# Altium project EASY-EAI-Nano-TB V1.01.PrjPcb (part 3 of 4)

## Sheet 09.Ethernet-RGMII.SchDoc
size A3; CheckDate: CheckedDate; CheckedBy: YPC; DocumentNumber: 9; Revision: V1.00; SheetNumber: 09; SheetTotal: 18; SheetName: Ethernet-RGMII; SheetDescribe: 千兆以太网; Designer: JOW; DesignDate: 2025-04-25; CheckedData: 2025-04-25; Rule: PcbType=ProtelPcb
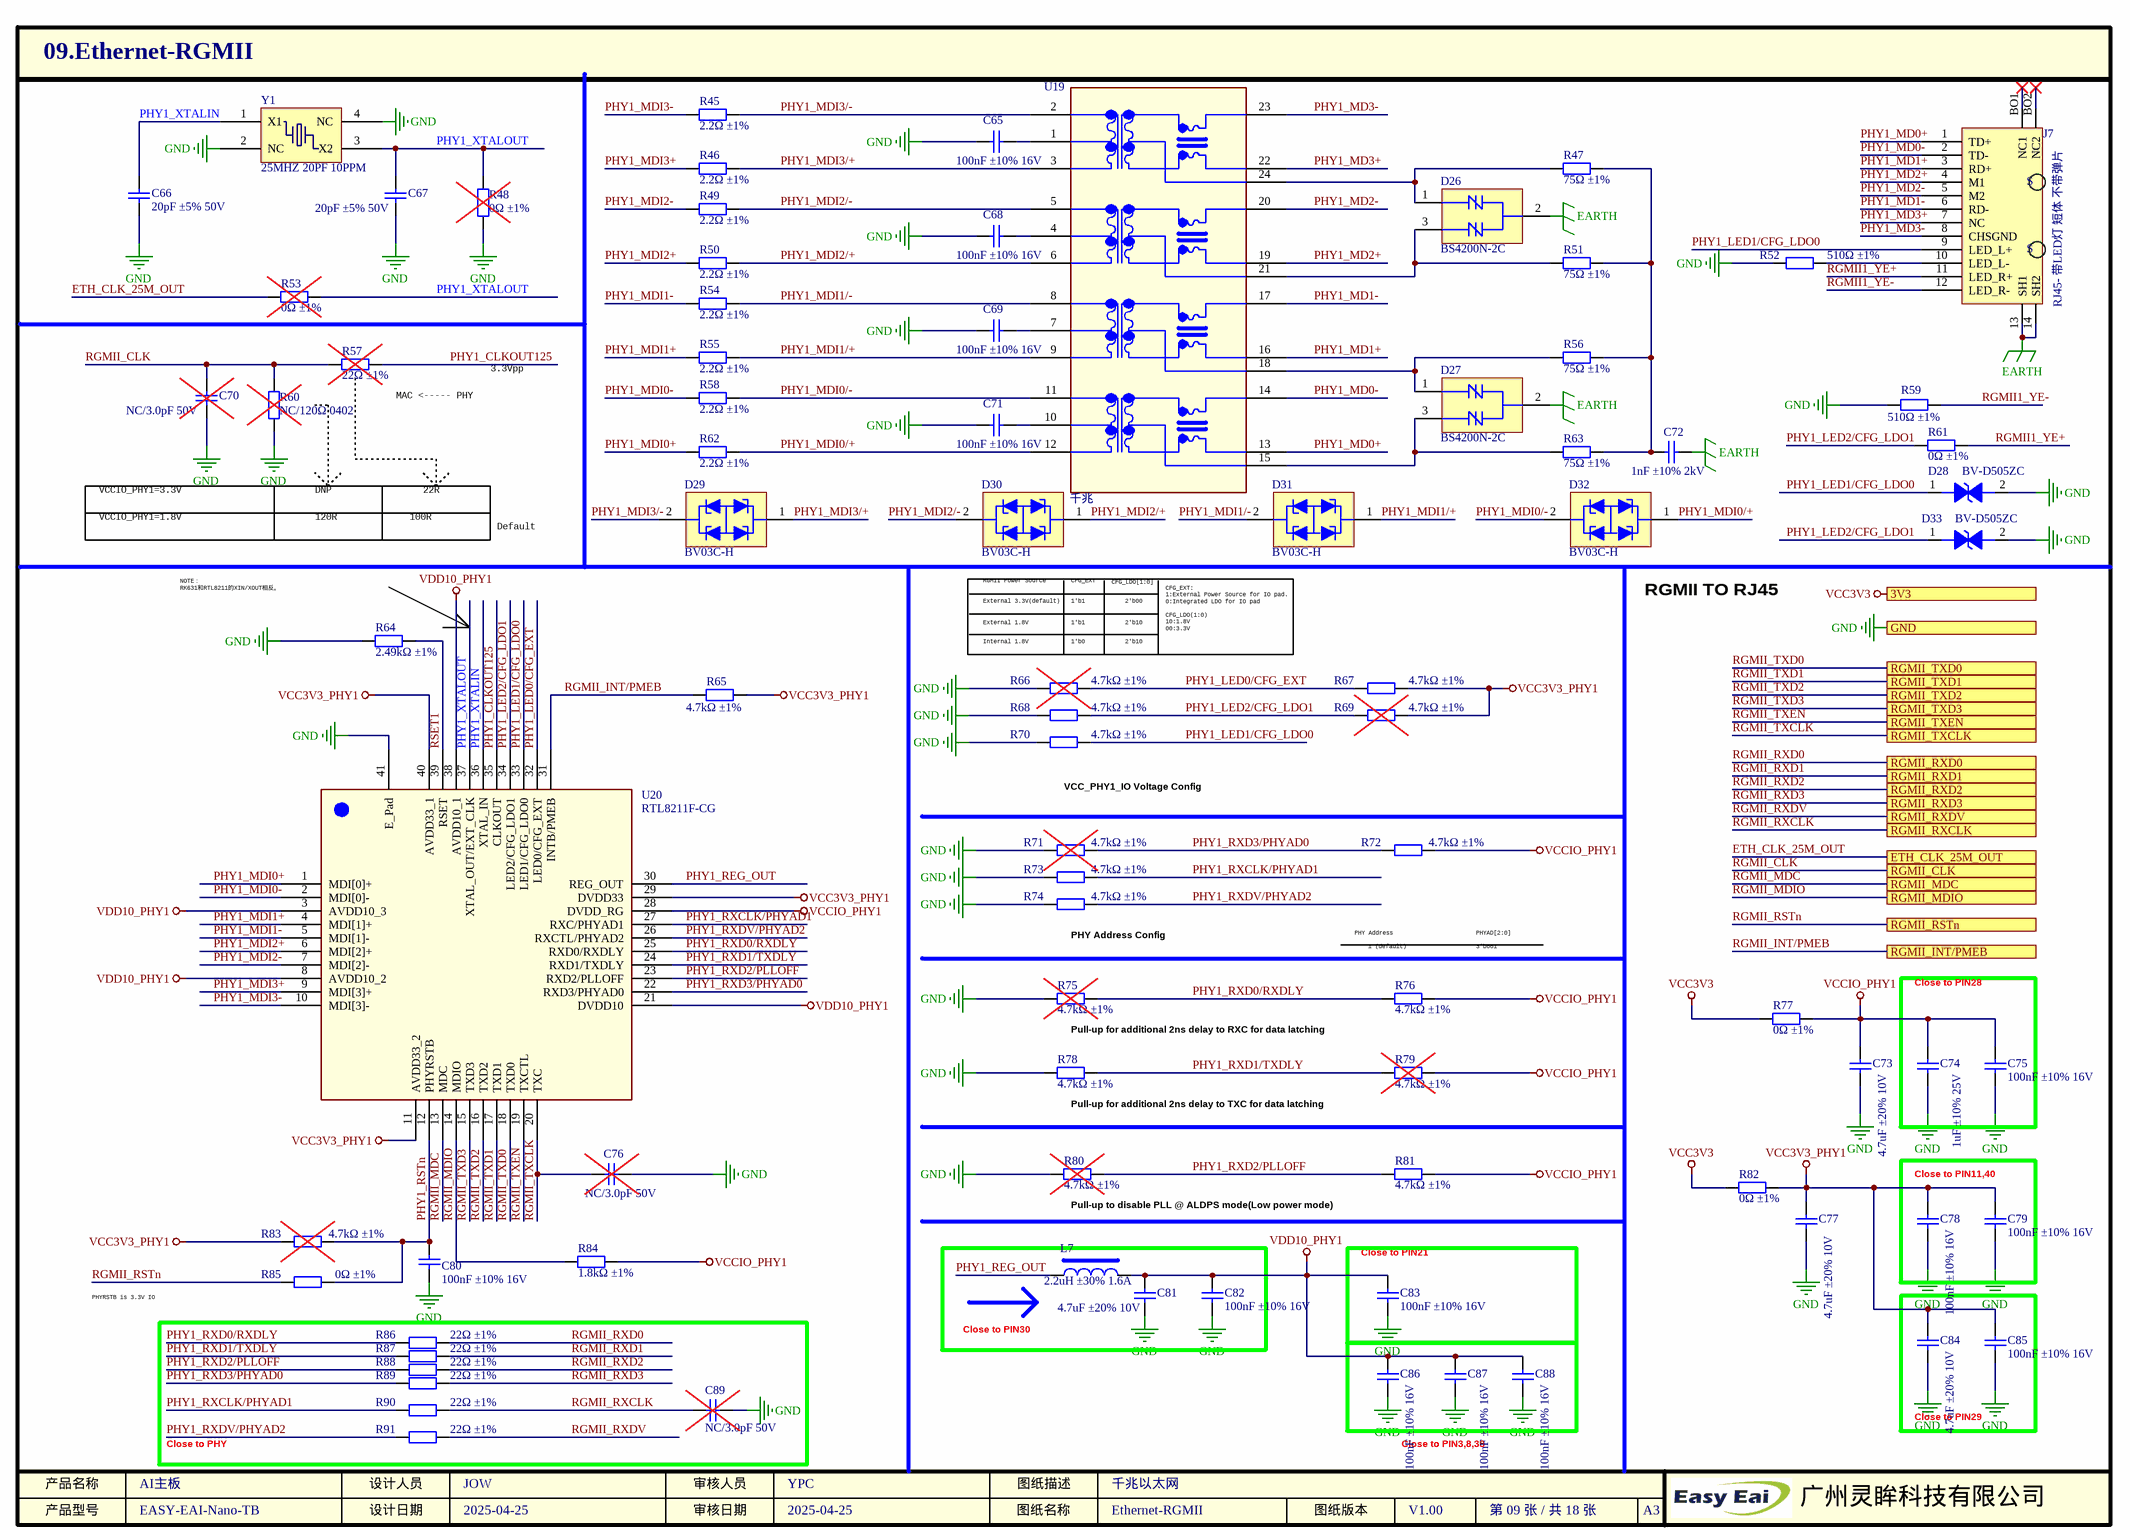
[diagram p12: 09.Ethernet-RGMII.SchDoc]

### Parts
C65  描述: 100nF ±10% 16V  [0402_C]  (hidden comment: CL05B104KO5NNNC)
C66  描述: 20pF ±5% 50V  [0402_C]  (hidden comment: 0402CG200J500NT)
C67  描述: 20pF ±5% 50V  [0402_C]  (hidden comment: 0402CG200J500NT)
C68  描述: 100nF ±10% 16V  [0402_C]  (hidden comment: CL05B104KO5NNNC)
C69  描述: 100nF ±10% 16V  [0402_C]  (hidden comment: CL05B104KO5NNNC)
C70  NC/3.0pF 50V  [0402_C]  (no BOM)
C71  描述: 100nF ±10% 16V  [0402_C]  (hidden comment: CL05B104KO5NNNC)
C72  描述: 1nF ±10% 2kV  [1206_C]  (hidden comment: CC1206KKX7RDBB102)
C73  描述: 4.7uF ±20% 10V  [0402_C]  (hidden comment: CL05A475MP5NRNC)
C74  描述: 1uF ±10% 25V  [0402_C]  (hidden comment: CL05A105KA5NQNC)
C75  描述: 100nF ±10% 16V  [0402_C]  (hidden comment: CL05B104KO5NNNC)
C76  NC/3.0pF 50V  [0402_C]  (no BOM)
C77  描述: 4.7uF ±20% 10V  [0402_C]  (hidden comment: CL05A475MP5NRNC)
C78  描述: 100nF ±10% 16V  [0402_C]  (hidden comment: CL05B104KO5NNNC)
C79  描述: 100nF ±10% 16V  [0402_C]  (hidden comment: CL05B104KO5NNNC)
C80  描述: 100nF ±10% 16V  [0402_C]  (hidden comment: CL05B104KO5NNNC)
C81  描述: 4.7uF ±20% 10V  [0402_C]  (hidden comment: CL05A475MP5NRNC)
C82  描述: 100nF ±10% 16V  [0402_C]  (hidden comment: CL05B104KO5NNNC)
C83  描述: 100nF ±10% 16V  [0402_C]  (hidden comment: CL05B104KO5NNNC)
C84  描述: 4.7uF ±20% 10V  [0402_C]  (hidden comment: CL05A475MP5NRNC)
C85  描述: 100nF ±10% 16V  [0402_C]  (hidden comment: CL05B104KO5NNNC)
C86  描述: 100nF ±10% 16V  [0402_C]  (hidden comment: CL05B104KO5NNNC)
C87  描述: 100nF ±10% 16V  [0402_C]  (hidden comment: CL05B104KO5NNNC)
C88  描述: 100nF ±10% 16V  [0402_C]  (hidden comment: CL05B104KO5NNNC)
C89  NC/3.0pF 50V  [0402_C]  (no BOM)
D26  BS4200N-2C  [SMB-T_L5.4-W3.3-BI]
D27  BS4200N-2C  [SMB-T_L5.4-W3.3-BI]
D28  BV-D505ZC  [SOD-523]
D29  BV03C-H  [SOD-323]
D30  BV03C-H  [SOD-323]
D31  BV03C-H  [SOD-323]
D32  BV03C-H  [SOD-323]
D33  BV-D505ZC  [SOD-523]
J7  R-RJ45R08P-C000  [RJ45/LED-1575X1626X1310]  (value not drawn)
L7  SWPA3015S2R2NT  [IND-SMD_L3.0-W3.0]  (value not drawn)
R45  描述: 2.2Ω ±1%  [0402_R]  (hidden comment: 0402WGF220KTCE)
R46  描述: 2.2Ω ±1%  [0402_R]  (hidden comment: 0402WGF220KTCE)
R47  描述: 75Ω ±1%  [0805_R]  (hidden comment: RS-05K75R0FT)
R48  描述: 0Ω ±1%  [0402_R]  (hidden comment: NC/0402WGF0000TCE)  (no BOM)
R49  描述: 2.2Ω ±1%  [0402_R]  (hidden comment: 0402WGF220KTCE)
R50  描述: 2.2Ω ±1%  [0402_R]  (hidden comment: 0402WGF220KTCE)
R51  描述: 75Ω ±1%  [0805_R]  (hidden comment: RS-05K75R0FT)
R52  描述: 510Ω ±1%  [0402_R]  (hidden comment: 0402WGF5100TCE)
R53  描述: 0Ω ±1%  [0402_R]  (hidden comment: NC/0402WGF0000TCE)  (no BOM)
R54  描述: 2.2Ω ±1%  [0402_R]  (hidden comment: 0402WGF220KTCE)
R55  描述: 2.2Ω ±1%  [0402_R]  (hidden comment: 0402WGF220KTCE)
R56  描述: 75Ω ±1%  [0805_R]  (hidden comment: RS-05K75R0FT)
R57  描述: 22Ω ±1%  [0402_R]  (hidden comment: 0402WGF220JTCE)  (no BOM)
R58  描述: 2.2Ω ±1%  [0402_R]  (hidden comment: 0402WGF220KTCE)
R59  描述: 510Ω ±1%  [0402_R]  (hidden comment: 0402WGF5100TCE)
R60  NC/120Ω 0402  [0402_R]  (no BOM)
R61  描述: 0Ω ±1%  [0402_R]  (hidden comment: 0402WGF0000TCE)
R62  描述: 2.2Ω ±1%  [0402_R]  (hidden comment: 0402WGF220KTCE)
R63  描述: 75Ω ±1%  [0805_R]  (hidden comment: RS-05K75R0FT)
R64  描述: 2.49kΩ ±1%  [0402_R]  (hidden comment: AC0402FR-072K49L)
R65  描述: 4.7kΩ ±1%  [0402_R]  (hidden comment: 0402WGF4701TCE)
R66  描述: 4.7kΩ ±1%  [0402_R]  (hidden comment: NC/0402WGF4701TCE)  (no BOM)
R67  描述: 4.7kΩ ±1%  [0402_R]  (hidden comment: 0402WGF4701TCE)
R68  描述: 4.7kΩ ±1%  [0402_R]  (hidden comment: 0402WGF4701TCE)
R69  描述: 4.7kΩ ±1%  [0402_R]  (hidden comment: NC/0402WGF4701TCE)  (no BOM)
R70  描述: 4.7kΩ ±1%  [0402_R]  (hidden comment: 0402WGF4701TCE)
R71  描述: 4.7kΩ ±1%  [0402_R]  (hidden comment: NC/0402WGF4701TCE)  (no BOM)
R72  描述: 4.7kΩ ±1%  [0402_R]  (hidden comment: 0402WGF4701TCE)
R73  描述: 4.7kΩ ±1%  [0402_R]  (hidden comment: 0402WGF4701TCE)
R74  描述: 4.7kΩ ±1%  [0402_R]  (hidden comment: 0402WGF4701TCE)
R75  描述: 4.7kΩ ±1%  [0402_R]  (hidden comment: NC/0402WGF4701TCE)  (no BOM)
R76  描述: 4.7kΩ ±1%  [0402_R]  (hidden comment: 0402WGF4701TCE)
R77  描述: 0Ω ±1%  [0402_R]  (hidden comment: 0402WGF0000TCE)
R78  描述: 4.7kΩ ±1%  [0402_R]  (hidden comment: 0402WGF4701TCE)
R79  描述: 4.7kΩ ±1%  [0402_R]  (hidden comment: NC/0402WGF4701TCE)  (no BOM)
R80  描述: 4.7kΩ ±1%  [0402_R]  (hidden comment: NC/0402WGF4701TCE)  (no BOM)
R81  描述: 4.7kΩ ±1%  [0402_R]  (hidden comment: 0402WGF4701TCE)
R82  描述: 0Ω ±1%  [0402_R]  (hidden comment: 0402WGF0000TCE)
R83  描述: 4.7kΩ ±1%  [0402_R]  (hidden comment: NC/0402WGF4701TCE)  (no BOM)
R84  描述: 1.8kΩ ±1%  [0402_R]  (hidden comment: 0402WGF1801TCE)
R85  描述: 0Ω ±1%  [0402_R]  (hidden comment: 0402WGF0000TCE)
R86  描述: 22Ω ±1%  [0402_R]  (hidden comment: 0402WGF220JTCE)
R87  描述: 22Ω ±1%  [0402_R]  (hidden comment: 0402WGF220JTCE)
R88  描述: 22Ω ±1%  [0402_R]  (hidden comment: 0402WGF220JTCE)
R89  描述: 22Ω ±1%  [0402_R]  (hidden comment: 0402WGF220JTCE)
R90  描述: 22Ω ±1%  [0402_R]  (hidden comment: 0402WGF220JTCE)
R91  描述: 22Ω ±1%  [0402_R]  (hidden comment: 0402WGF220JTCE)
U19  描述: 千兆  [SMD-24_L15.1-W7.1-P1.00-LS10.0-BL]  (hidden comment: G2401CE)
U20  RTL8211F-CG  [QFN40P500X500X90_HS-41N]
Y1  X322525MSB4SI  [SMD-3225_4P]  (value not drawn)

### Blocks framed on the sheet
Close to PIN28: C74 C75
Close to PIN11,40: C78 C79
Close to PIN30: C81 C82 L7
Close to PIN21: C83
Close to PHY: C89 R86-R91
Close to PIN29: C84 C85

### Ports
3V3, ETH_CLK_25M_OUT, GND, RGMII_CLK, RGMII_INT/PMEB, RGMII_MDC, RGMII_MDIO, RGMII_RSTn, RGMII_RXCLK, RGMII_RXD0, RGMII_RXD1, RGMII_RXD2, RGMII_RXD3, RGMII_RXDV, RGMII_TXCLK, RGMII_TXD0, RGMII_TXD1, RGMII_TXD2, RGMII_TXD3, RGMII_TXEN

### Nets
EARTH: C72.2 D26.2 D27.2 J7.13(SH1) J7.14(SH2)
GND: C65.1 C66.1 C67.1 C68.1 C69.1 C70.1 C71.1 C73.1 C74.1 C75.1 C76.2 C77.1 C78.1 C79.1 C80.1 C81.1 C82.1 C83.1 C84.1 C85.1 C86.1 C87.1 C88.1 C89.1 D28.2 D33.2 R48.1 R52.1 R59.1 R60.1 R64.1 R66.1 R68.1 R70.1 R71.1 R73.1 R74.1 R75.1 R78.1 R80.1 U20.41(E_Pad) Y1.2(NC) Y1.4(NC) ; port GND  [project net CHIP_GND]
VCC3V3: R77.1 R82.1 ; port 3V3
VCC3V3_PHY1: C77.2 C78.2 C79.2 C84.2 C85.2 R65.2 R67.2 R69.2 R82.2 R83.1 U20.11(AVDD33_2) U20.29(DVDD33) U20.40(AVDD33_1)
VCCIO_PHY1: C73.2 C74.2 C75.2 R72.2 R76.2 R77.2 R79.2 R81.2 R84.2 U20.28(DVDD_RG)
VDD10_PHY1: C81.2 C82.2 C83.2 C86.2 C87.2 C88.2 L7.2 U20.3(AVDD10_3) U20.8(AVDD10_2) U20.21(DVDD10) U20.38(AVDD10_1)
ETH_CLK_25M_OUT: R53.2 ; port ETH_CLK_25M_OUT
PHY1_CLKOUT125: R57.2 U20.35(CLKOUT)
PHY1_LED0/CFG_EXT: R66.2 R67.1 U20.32(LED0/CFG_EXT)
PHY1_LED1/CFG_LDO0: D28.1 J7.9(LED_L+) R70.2 U20.33(LED1/CFG_LDO0)
PHY1_LED2/CFG_LDO1: D33.1 R61.1 R68.2 R69.1 U20.34(LED2/CFG_LDO1)
PHY1_MD0+: J7.1(TD+) U19.13
PHY1_MD0-: J7.2(TD-) U19.14
PHY1_MD1+: J7.3(RD+) U19.16
PHY1_MD1-: J7.6(RD-) U19.17
PHY1_MD2+: J7.4(M1) U19.19
PHY1_MD2-: J7.5(M2) U19.20
PHY1_MD3+: J7.7(NC) U19.22
PHY1_MD3-: J7.8(CHSGND) U19.23
PHY1_MDI0+: R62.1 U20.1(MDI[0]+)
PHY1_MDI0-: R58.1 U20.2(MDI[0]-)
PHY1_MDI0/+: D32.1 R62.2 U19.12
PHY1_MDI0/-: D32.2 R58.2 U19.11
PHY1_MDI1+: R55.1 U20.4(MDI[1]+)
PHY1_MDI1-: R54.1 U20.5(MDI[1]-)
PHY1_MDI1/+: D31.1 R55.2 U19.9
PHY1_MDI1/-: D31.2 R54.2 U19.8
PHY1_MDI2+: R50.1 U20.6(MDI[2]+)
PHY1_MDI2-: R49.1 U20.7(MDI[2]-)
PHY1_MDI2/+: D30.1 R50.2 U19.6
PHY1_MDI2/-: D30.2 R49.2 U19.5
PHY1_MDI3+: R46.1 U20.9(MDI[3]+)
PHY1_MDI3-: R45.1 U20.10(MDI[3]-)
PHY1_MDI3/+: D29.1 R46.2 U19.3
PHY1_MDI3/-: D29.2 R45.2 U19.2
PHY1_REG_OUT: L7.1 U20.30(REG_OUT)
PHY1_RSTn: C80.2 R83.2 R85.2 U20.12(PHYRSTB)
PHY1_RXCLK/PHYAD1: R73.2 R90.1 U20.27(RXC/PHYAD1)
PHY1_RXD0/RXDLY: R75.2 R76.1 R86.1 U20.25(RXD0/RXDLY)
PHY1_RXD1/TXDLY: R78.2 R79.1 R87.1 U20.24(RXD1/TXDLY)
PHY1_RXD2/PLLOFF: R80.2 R81.1 R88.1 U20.23(RXD2/PLLOFF)
PHY1_RXD3/PHYAD0: R71.2 R72.1 R89.1 U20.22(RXD3/PHYAD0)
PHY1_RXDV/PHYAD2: R74.2 R91.1 U20.26(RXCTL/PHYAD2)
PHY1_XTALIN: C66.2 U20.36(XTAL_IN) Y1.1(X1)
PHY1_XTALOUT: C67.2 R48.2 R53.1 U20.37(XTAL_OUT/EXT_CLK) Y1.3(X2)
RGMII1_YE+: J7.11(LED_R+) R61.2
RGMII1_YE-: J7.12(LED_R-) R59.2
RGMII_CLK: C70.2 R57.1 R60.2 ; port RGMII_CLK
RGMII_INT/PMEB: R65.1 U20.31(INTB/PMEB) ; port RGMII_INT/PMEB
RGMII_MDC: U20.13(MDC) ; port RGMII_MDC
RGMII_MDIO: R84.1 U20.14(MDIO) ; port RGMII_MDIO
RGMII_RSTn: R85.1 ; port RGMII_RSTn
RGMII_RXCLK: C89.2 R90.2 ; port RGMII_RXCLK
RGMII_RXD0: R86.2 ; port RGMII_RXD0
RGMII_RXD1: R87.2 ; port RGMII_RXD1
RGMII_RXD2: R88.2 ; port RGMII_RXD2
RGMII_RXD3: R89.2 ; port RGMII_RXD3
RGMII_RXDV: R91.2 ; port RGMII_RXDV
RGMII_TXCLK: C76.1 U20.20(TXC) ; port RGMII_TXCLK
RGMII_TXD0: U20.18(TXD0) ; port RGMII_TXD0
RGMII_TXD1: U20.17(TXD1) ; port RGMII_TXD1
RGMII_TXD2: U20.16(TXD2) ; port RGMII_TXD2
RGMII_TXD3: U20.15(TXD3) ; port RGMII_TXD3
RGMII_TXEN: U20.19(TXCTL) ; port RGMII_TXEN
RSET1: R64.2 U20.39(RSET)
NetC65_2: C65.2 U19.1
NetC68_2: C68.2 U19.4
NetC69_2: C69.2 U19.7
NetC71_2: C71.2 U19.10
NetC72_1: C72.1 R47.2 R51.2 R56.2 R63.2
NetD26_1: D26.1 R47.1 U19.24
NetD26_3: D26.3 R51.1 U19.21
NetD27_1: D27.1 R56.1 U19.18
NetD27_3: D27.3 R63.1 U19.15
NetJ7_10: J7.10(LED_L-) R52.2

Not connected (* = marked no-connect by the designer): J7 BO1(NC1)* BO2(NC2)*

### Notes on the sheet
- (near R57) MAC <----- PHY
- 3.3Vpp
- VCCIO_PHY1=3.3V
- VCCIO_PHY1=1.8V
- DNP
- 120R
- 100R
- 22R
- Default
- (near R64) NOTE：
  RK631和RTL8211的XIN/XOUT相反。
- RGMII Power Source
- External 3.3V(default)
- CFG_EXT
- 1'b1
- CFG_LDO[1:0]
- 2'b00
- RGMII TO RJ45
- External 1.8V
- Internal 1.8V
- (near R66) 1'b0
- 2'b10
- CFG_EXT:
  1:External Power Source for IO pad.
  0:Integrated LDO for IO pad
  CFG_LDO(1:0)
  10:1.8V
  00:3.3V
- VCC_PHY1_IO Voltage Config
- (near R74) PHY Address Config
- PHY Address
- PHYAD[2:0]
- (near R76) 1 (default)
- 3'b001
- Pull-up for additional 2ns delay to RXC for data latching
- (near R78) Pull-up for additional 2ns delay to TXC for data latching
- (near R80) Pull-up to disable PLL @ ALDPS mode(Low power mode)
- PHYRSTB is 3.3V IO
- Close to PIN3,8,38
- 产品名称
- 产品型号
- 设计人员
- 设计日期
- 审核人员
- 审核日期
- 图纸名称
- 图纸描述
- 图纸版本
- A3
- 广州灵眸科技有限公司
- (in symbol RJ45- 带LED灯 短体 不带弹片) S

### Library data of the parts
C65 C68 C69 C71 C75 C78-C80 C82 C83 C85-C88 = 0402 100nF ±10% 16V: as C212 on sheet 17.Other; 型号: CL05B104KO5NNNC; SuppliersPartNumber: C1525; 商品编号: SPZL000259
C66 C67 = 0402 20pF ±5% 50V: SPZL000398; 名称: 贴片电容; 厂商: FH(风华); 封装: 0402; 工作温度: -55~125℃; 贴片和直插: SMD; 型号: 0402CG200J500NT; SuppliersPartNumber: C1554; 商品编号: SPZL000398
C70 C76 C89 = 0402 2.0pF (2R0) 0.25pF 50V: 贴片电容; ComponentLink1Description: 供应商链接; ComponentLink1URL: http://www.szlcsc.com/product/details_1910.html; Package: 0402; Supplier: LC
C72 = 1206 1nF ±10% 2kV: SPZL000332; 名称: 贴片电容; 厂商: YAGEO(国巨); 封装: 1206; 工作温度: -55~125℃; 贴片和直插: SMD; 型号: CC1206KKX7RDBB102; SuppliersPartNumber: C23631; 商品编号: SPZL000332
C73 C77 C81 C84 = 0402 4.7uF ±20% 10V: SPZL000339; 名称: 贴片电容; 厂商: SAMSUNG(三星); 封装: 0402; 工作温度: -55~85℃; 贴片和直插: SMD; 型号: CL05A475MP5NRNC; SuppliersPartNumber: C23733; 商品编号: SPZL000339
C74 = 0402 1uF ±10% 25V: as C213 on sheet 17.Other; 型号: CL05A105KA5NQNC; SuppliersPartNumber: C52923; 商品编号: SPZL000337
D26 D27 = 放电管 BS4200N-2C: SPZL000612; 名称: 放电管; 封装: SMB-T; 贴片和直插: SMD; 厂商: Bencent(槟城); 工作温度: -40~125℃; 商品编号: SPZL000612; 型号: BS4200N-2C
D28 D33 = ESD BV-D505ZC: SPZL000613; 名称: ESD; 贴片和直插: SMD; 厂商: Bencent(槟城); 描述: Vdrm=5V Cj=15pF; 工作温度: -40~125℃; SuppliersPartNumber: C459520; 封装: SOD-523; 商品编号: SPZL000613; 型号: BV-D505ZC
D29-D32 = ESD BV03C-H: SPZL000614; 名称: ESD; 贴片和直插: SMD; 厂商: Bencent(槟城); 描述: Vdrm=3.3V Cj=1.5pF; 工作温度: -55~150℃; 封装: SOD-323; SuppliersPartNumber: C883203; 商品编号: SPZL000614; 型号: BV03C-H
J7 = RJ45- 带LED灯 短体 不带弹片: SPZL000140; 名称: RJ45插座; 贴片和直插: THT; 封装: Through Hole; 厂商: Ckmtw(灿科盟); 工作温度: 0~70℃; SuppliersPartNumber: C386757; 型号: R-RJ45R08P-C000; 商品编号: SPZL000140; 描述: RJ45- 带LED灯 短体 不带弹片
L7 = 2.2uH ±30% 1.6A: SPZL000721; 名称: 电感; 厂商: Sunlord(顺络); 封装: SMD; 工作温度: -40~125℃; 型号: SWPA3015S2R2NT; SuppliersPartNumber: C19734; 贴片和直插: SMD; 商品编号: SPZL000721; 描述: 2.2uH ±30% 1.6A
R45 R46 R49 R50 R54 R55 R58 R62 = 0402 2.2Ω ±1%: as R217 on sheet 17.Other; SuppliersPartNumber: C25101; 型号: 0402WGF220KTCE; 商品编号: SPZL000327
R47 R51 R56 R63 = 0805 75Ω ±1%: SPZL000353; 封装: 0805; 厂商: FH(风华); 名称: 电阻; 贴片和直插: SMD; 工作温度: -55~155℃; SuppliersPartNumber: C139842; 型号: RS-05K75R0FT; 商品编号: SPZL000353
R48 R53 R61 R77 R82 R85 = 0402 0Ω ±1%: as R4 on sheet 05.Audio; SuppliersPartNumber: C17168; 型号: 0402WGF0000TCE; 商品编号: SPZL000276
R52 R59 = 0402 510Ω ±1%: SPZL000335; 封装: 0402; 厂商: UNI-ROYAL(厚声); 贴片和直插: SMD; 名称: 电阻; 工作温度: -55~155℃; SuppliersPartNumber: C25123; 型号: 0402WGF5100TCE; 商品编号: SPZL000335
R57 R86-R91 = 0402 22Ω ±1%: SPZL000279; 封装: 0402; 厂商: UNI-ROYAL(厚声); 贴片和直插: SMD; 名称: 电阻; 工作温度: -55~155℃; SuppliersPartNumber: C25092; 型号: 0402WGF220JTCE; 商品编号: SPZL000279
R60 = 0402 120Ω (1200) 1%: 贴片电阻; ComponentLink1Description: 供应商链接; ComponentLink1URL: http://www.szlcsc.com/product/details_25822.html; Package: 0402; Supplier: LC; SuppliersPartNumber: C25079
R64 = 0402 2.49kΩ ±1%: SPZL000354; 封装: 0402; 厂商: YAGEO(国巨); 贴片和直插: SMD; 名称: 电阻; 工作温度: -55~155℃; SuppliersPartNumber: C226959; 型号: AC0402FR-072K49L; 商品编号: SPZL000354
R65-R76 R78-R81 R83 = 0402 4.7kΩ ±1%: SPZL000280; 封装: 0402; 厂商: UNI-ROYAL(厚声); 贴片和直插: SMD; 名称: 电阻; 工作温度: -55~155℃; SuppliersPartNumber: C25900; 型号: 0402WGF4701TCE; 商品编号: SPZL000280
R84 = 0402 1.8kΩ ±1%: SPZL000899; 封装: 0402; 厂商: UNI-ROYAL(厚声); 贴片和直插: SMD; 名称: 电阻; 工作温度: -55~155℃; SuppliersPartNumber: C25871; 型号: 0402WGF1801TCE; 商品编号: SPZL000899
U19 = 网络变压器 G2401CE: SPZL000720; 封装: SMD; 名称: 网络变压器; 厂商: Mentech(铭普光磁); 工作温度: -40~+85℃; 型号: G2401CE; 贴片和直插: SMD; SuppliersPartNumber: C2904710; 商品编号: SPZL000720
U20 = RTL8211F-CG: SPZL000719; 名称: IC; 封装: WQFN-40-EP(5x5); 厂商: REALTEK(瑞昱); 贴片和直插: SMD; 工作温度: 0~70℃; 描述: RTL8211F-CG; 商品编号: SPZL000719; SuppliersPartNumber: C187932; 型号: RTL8211F-CG
Y1 = 25MHZ 20PF 10PPM: SPZL000475; 封装: SMD3225-4P; 厂商: YXC扬兴科技; 贴片和直插: SMD; 名称: 无源晶振; 工作温度: -40~85℃; SuppliersPartNumber: C13740; 型号: X322525MSB4SI; 商品编号: SPZL000475; 描述: 25MHZ 20PF 10PPM

## Sheet 15.Raspberry_Pi_Interface.SchDoc
size A4; CheckedBy: YPC; DocumentNumber: 15; Revision: V1.00; SheetNumber: 15; SheetTotal: 18; SheetName: Raspberry_Pi_Interface; SheetDescribe: SheetDescribe; Designer: JOW; DesignDate: 2025-04-25; CheckedData: 2025-04-25; Rule: PcbType=ProtelPcb
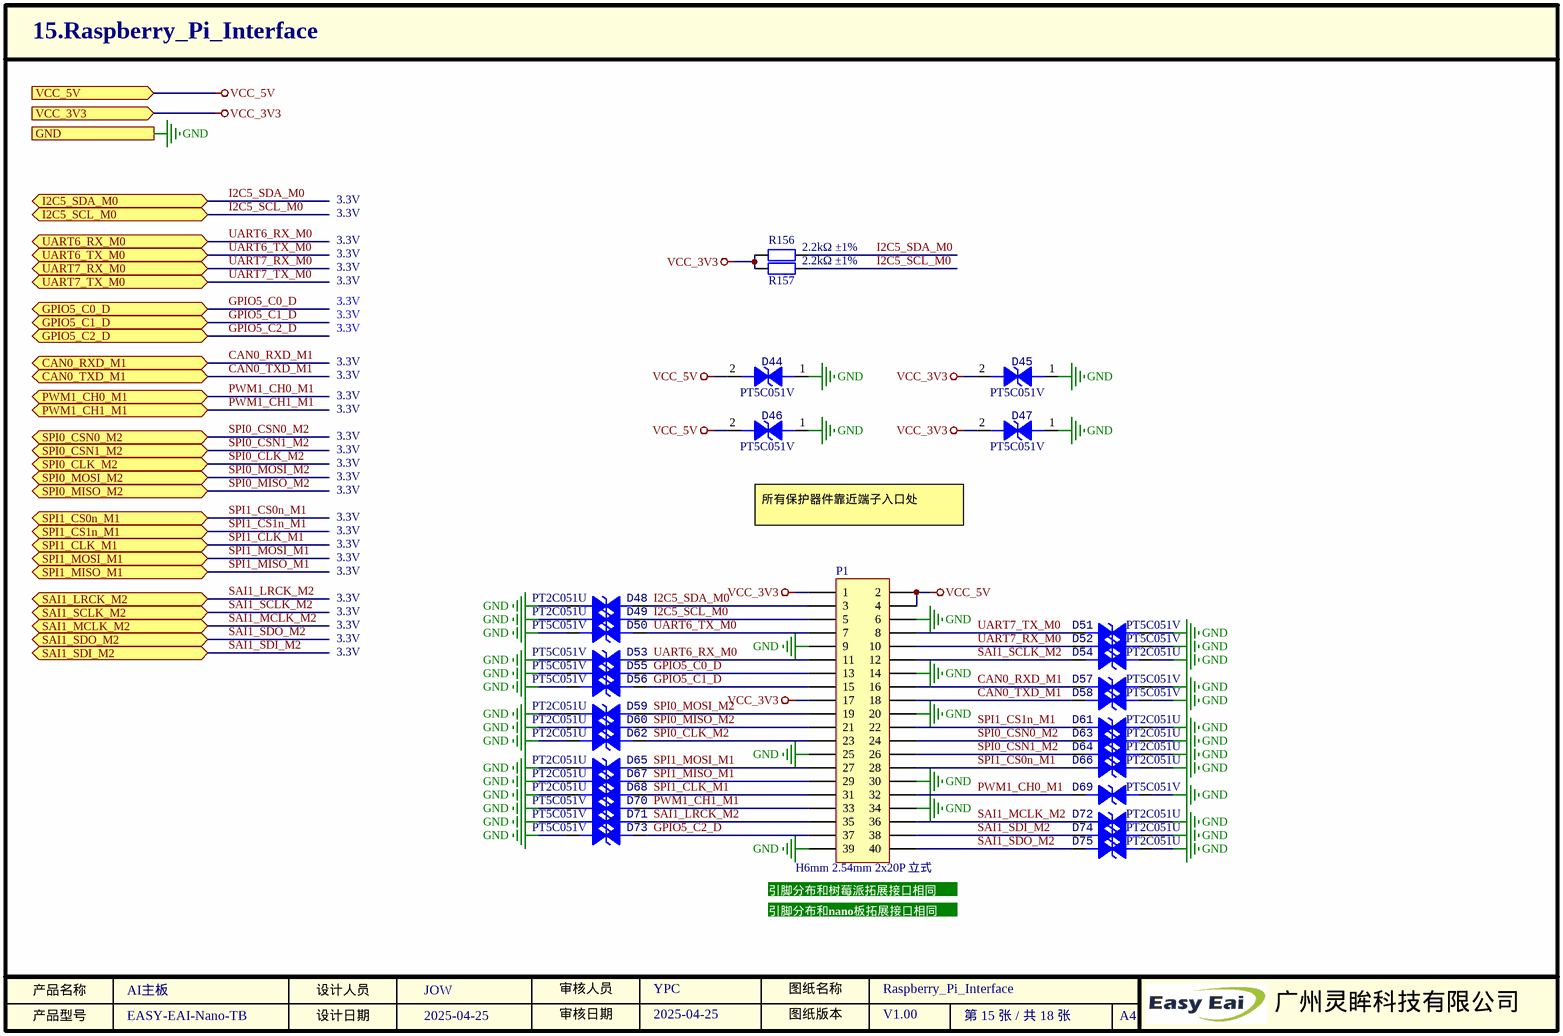
[diagram p13: 15.Raspberry_Pi_Interface.SchDoc]

### Parts
D44  PT5C051V  [SOD-523]
D45  PT5C051V  [SOD-523]
D46  PT5C051V  [SOD-523]
D47  PT5C051V  [SOD-523]
D48  PT2C051U  [DFN1006]
D49  PT2C051U  [DFN1006]
D50  PT5C051V  [SOD-523]
D51  PT5C051V  [SOD-523]
D52  PT5C051V  [SOD-523]
D53  PT5C051V  [SOD-523]
D54  PT2C051U  [DFN1006]
D55  PT5C051V  [SOD-523]
D56  PT5C051V  [SOD-523]
D57  PT5C051V  [SOD-523]
D58  PT5C051V  [SOD-523]
D59  PT2C051U  [DFN1006]
D60  PT2C051U  [DFN1006]
D61  PT2C051U  [DFN1006]
D62  PT2C051U  [DFN1006]
D63  PT2C051U  [DFN1006]
D64  PT2C051U  [DFN1006]
D65  PT2C051U  [DFN1006]
D66  PT2C051U  [DFN1006]
D67  PT2C051U  [DFN1006]
D68  PT2C051U  [DFN1006]
D69  PT5C051V  [SOD-523]
D70  PT5C051V  [SOD-523]
D71  PT5C051V  [SOD-523]
D72  PT2C051U  [DFN1006]
D73  PT5C051V  [SOD-523]
D74  PT2C051U  [DFN1006]
D75  PT2C051U  [DFN1006]
P1  描述: H6mm 2.54mm 2x20P 立式  [HDR-TH_40P-P2.54-V-M-R2-C20-S2.54]  (hidden comment: B-2100S40P-B110)
R156  描述: 2.2kΩ ±1%  [0402_R]  (hidden comment: AC0402FR-072K2L)
R157  描述: 2.2kΩ ±1%  [0402_R]  (hidden comment: AC0402FR-072K2L)

### Ports
CAN0_RXD_M1, CAN0_TXD_M1, GND, GPIO5_C0_D, GPIO5_C1_D, GPIO5_C2_D, I2C5_SCL_M0, I2C5_SDA_M0, PWM1_CH0_M1, PWM1_CH1_M1, SAI1_LRCK_M2, SAI1_MCLK_M2, SAI1_SCLK_M2, SAI1_SDI_M2, SAI1_SDO_M2, SPI0_CLK_M2, SPI0_CSN0_M2, SPI0_CSN1_M2, SPI0_MISO_M2, SPI0_MOSI_M2, SPI1_CLK_M1, SPI1_CS0n_M1, SPI1_CS1n_M1, SPI1_MISO_M1, SPI1_MOSI_M1, UART6_RX_M0, UART6_TX_M0, UART7_RX_M0, UART7_TX_M0, VCC_3V3 (in), VCC_5V (in)

### Nets
GND: D44.1 D45.1 D46.1 D47.1 D48.1 D49.1 D50.1 D51.1 D52.1 D53.1 D54.2 D55.1 D56.1 D57.1 D58.1 D59.1 D60.1 D61.2 D62.1 D63.2 D64.2 D65.1 D66.2 D67.1 D68.1 D69.1 D70.1 D71.1 D72.2 D73.1 D74.2 D75.2 P1.6 P1.9 P1.14 P1.20 P1.25 P1.30 P1.34 P1.39 ; port GND  [project net CHIP_GND]
VCC_3V3: D45.2 D47.2 P1.1 P1.17 R156.1 R157.1 ; port VCC_3V3  [project net VCC3V3]
VCC_5V: D44.2 D46.2 P1.2 P1.4 ; port VCC_5V
CAN0_RXD_M1: D57.2 P1.16 ; port CAN0_RXD_M1
CAN0_TXD_M1: D58.2 P1.18 ; port CAN0_TXD_M1
GPIO5_C0_D: D55.2 P1.13 ; port GPIO5_C0_D
GPIO5_C1_D: D56.2 P1.15 ; port GPIO5_C1_D
GPIO5_C2_D: D73.2 P1.37 ; port GPIO5_C2_D
I2C5_SCL_M0: D49.2 P1.5 R157.2 ; port I2C5_SCL_M0
I2C5_SDA_M0: D48.2 P1.3 R156.2 ; port I2C5_SDA_M0
PWM1_CH0_M1: D69.2 P1.32 ; port PWM1_CH0_M1
PWM1_CH1_M1: D70.2 P1.33 ; port PWM1_CH1_M1
SAI1_LRCK_M2: D71.2 P1.35 ; port SAI1_LRCK_M2
SAI1_MCLK_M2: D72.1 P1.36 ; port SAI1_MCLK_M2
SAI1_SCLK_M2: D54.1 P1.12 ; port SAI1_SCLK_M2
SAI1_SDI_M2: D74.1 P1.38 ; port SAI1_SDI_M2
SAI1_SDO_M2: D75.1 P1.40 ; port SAI1_SDO_M2
SPI0_CLK_M2: D62.2 P1.23 ; port SPI0_CLK_M2
SPI0_CSN0_M2: D63.1 P1.24 ; port SPI0_CSN0_M2
SPI0_CSN1_M2: D64.1 P1.26 ; port SPI0_CSN1_M2
SPI0_MISO_M2: D60.2 P1.21 ; port SPI0_MISO_M2
SPI0_MOSI_M2: D59.2 P1.19 ; port SPI0_MOSI_M2
SPI1_CLK_M1: D68.2 P1.31 ; port SPI1_CLK_M1
SPI1_CS0n_M1: D66.1 P1.28 ; port SPI1_CS0n_M1
SPI1_CS1n_M1: D61.1 P1.22 ; port SPI1_CS1n_M1
SPI1_MISO_M1: D67.2 P1.29 ; port SPI1_MISO_M1
SPI1_MOSI_M1: D65.2 P1.27 ; port SPI1_MOSI_M1
UART6_RX_M0: D53.2 P1.11 ; port UART6_RX_M0
UART6_TX_M0: D50.2 P1.7 ; port UART6_TX_M0
UART7_RX_M0: D52.2 P1.10 ; port UART7_RX_M0
UART7_TX_M0: D51.2 P1.8 ; port UART7_TX_M0

### Notes on the sheet
- 3.3V
- 所有保护器件靠近端子入口处
- (near P1) 引脚分布和树莓派拓展接口相同
- 引脚分布和nano板拓展接口相同
- 产品名称
- 产品型号
- 设计人员
- 设计日期
- 审核人员
- 审核日期
- 图纸版本
- 图纸名称
- A4
- 广州灵眸科技有限公司

### Library data of the parts
D44-D47 D50-D53 D55-D58 D69-D71 D73 = PT5C051V: SPZL001155; 名称: ESD; 贴片和直插: SMD; 厂商: 玛珂斯科技; 描述: Vrwm=5V,Vc=25V,Ipp=5A; 工作温度: -55~125℃; 封装: SOD-523; 商品编号: SPZL001155; 型号: PT5C051V
D48 D49 D54 D59-D68 D72 D74 D75 = PT2C051U: SPZL001147; 名称: ESD; 贴片和直插: SMD; 厂商: 玛珂斯科技; 描述: Vrwm=5V, Cj=0.3pF; 工作温度: -55~125℃; 封装: DFN1006; 商品编号: SPZL001147; 型号: PT2C051U
P1 = 排针 H6mm 2.54mm 2x20P 立式: SPZL000147; 名称: 排针; 封装: 插件,P=2.54mm; 贴片和直插: THT; 厂商: Ckmtw(灿科盟); 工作温度: -40~105℃; 型号: B-2100S40P-B110; 商品编号: SPZL000147; SuppliersPartNumber: C124383
R156 R157 = 0402 2.2kΩ ±1%: SPZL000307; 封装: 0402; 厂商: YAGEO(国巨); 贴片和直插: SMD; 名称: 电阻; 工作温度: -55~155℃; SuppliersPartNumber: C144773; 型号: AC0402FR-072K2L; 商品编号: SPZL000307

## Sheet 08.USB3.0-RGMII.SchDoc
size A3; CheckedBy: LJX; DocumentNumber: 8; Revision: V1.00; SheetNumber: 08; SheetTotal: 18; SheetName: USB3.0-RGMII; SheetDescribe: USB3.0-RGMII; Designer: JOW; DesignDate: 2025-05-20; CheckedData: 2025-05-21; Rule: PcbType=ProtelPcb
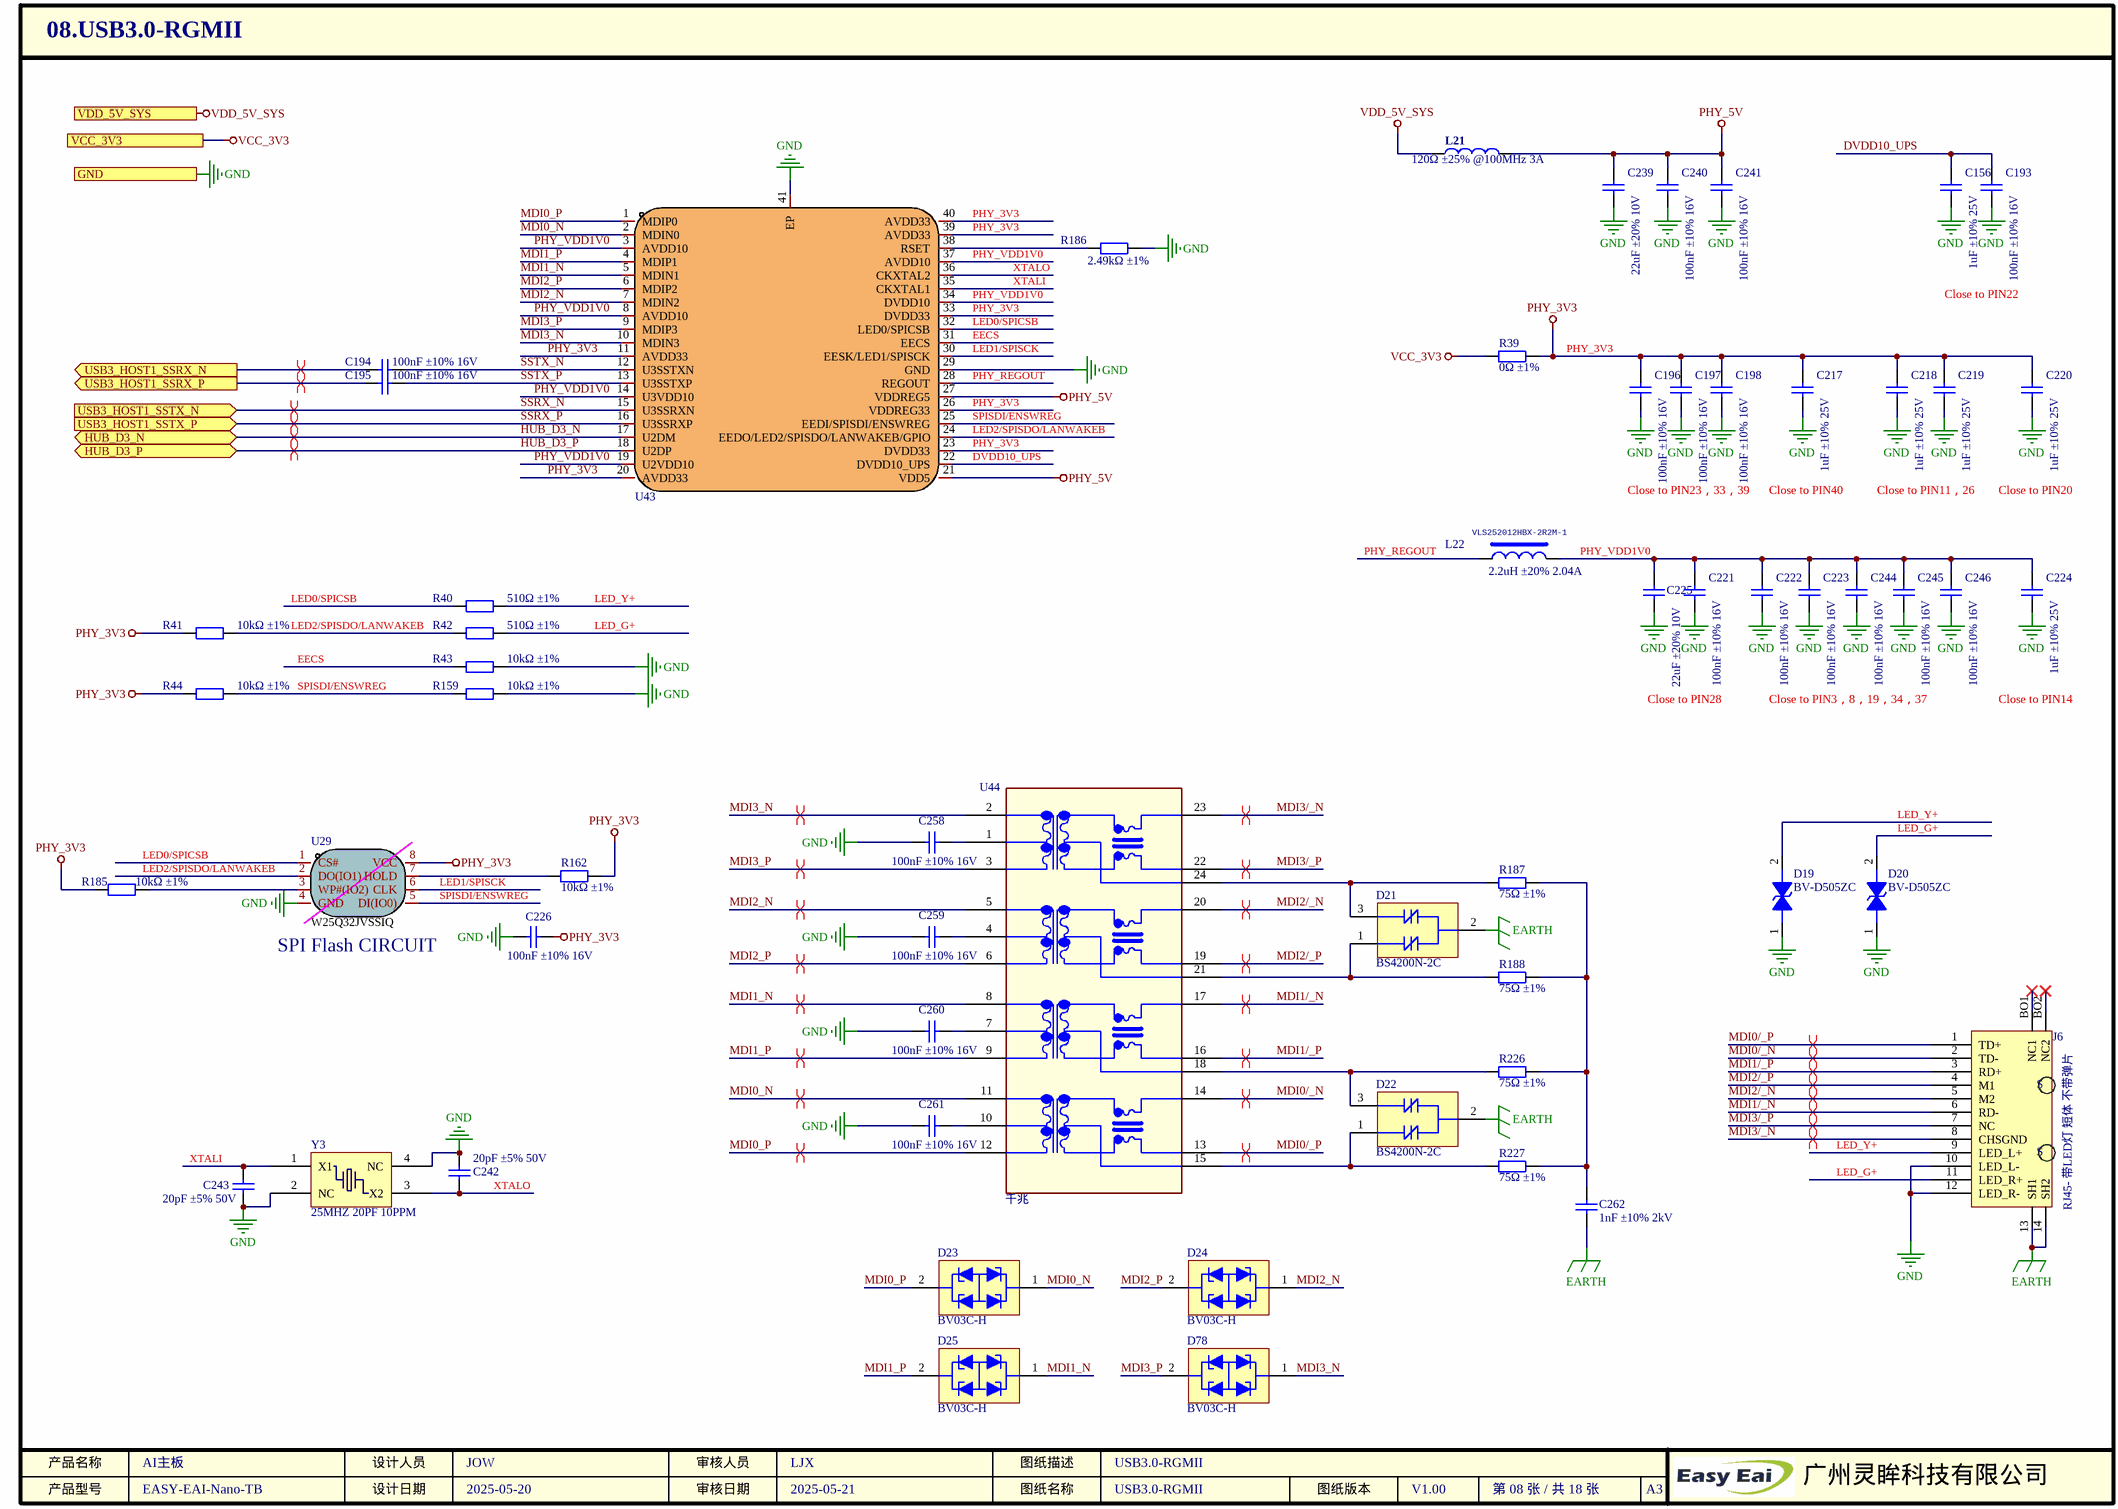
[diagram p14: 08.USB3.0-RGMII.SchDoc]

### Parts
C156  描述: 1uF ±10% 25V  [0402_C]  (hidden comment: CL05A105KA5NQNC)
C193  描述: 100nF ±10% 16V  [0402_C]  (hidden comment: CL05B104KO5NNNC)
C194  描述: 100nF ±10% 16V  [0402_C]  (hidden comment: CL05B104KO5NNNC)
C195  描述: 100nF ±10% 16V  [0402_C]  (hidden comment: CL05B104KO5NNNC)
C196  描述: 100nF ±10% 16V  [0402_C]  (hidden comment: CL05B104KO5NNNC)
C197  描述: 100nF ±10% 16V  [0402_C]  (hidden comment: CL05B104KO5NNNC)
C198  描述: 100nF ±10% 16V  [0402_C]  (hidden comment: CL05B104KO5NNNC)
C217  描述: 1uF ±10% 25V  [0402_C]  (hidden comment: CL05A105KA5NQNC)
C218  描述: 1uF ±10% 25V  [0402_C]  (hidden comment: CL05A105KA5NQNC)
C219  描述: 1uF ±10% 25V  [0402_C]  (hidden comment: CL05A105KA5NQNC)
C220  描述: 1uF ±10% 25V  [0402_C]  (hidden comment: CL05A105KA5NQNC)
C221  描述: 100nF ±10% 16V  [0402_C]  (hidden comment: CL05B104KO5NNNC)
C222  描述: 100nF ±10% 16V  [0402_C]  (hidden comment: CL05B104KO5NNNC)
C223  描述: 100nF ±10% 16V  [0402_C]  (hidden comment: CL05B104KO5NNNC)
C224  描述: 1uF ±10% 25V  [0402_C]  (hidden comment: CL05A105KA5NQNC)
C225  描述: 22uF ±20% 10V  [0603_C]  (hidden comment: CL10A226MP8NUNE)
C226  描述: 100nF ±10% 16V  [0402_C]  (hidden comment: CL05B104KO5NNNC)
C239  描述: 22uF ±20% 10V  [0603_C]  (hidden comment: CL10A226MP8NUNE)
C240  描述: 100nF ±10% 16V  [0402_C]  (hidden comment: CL05B104KO5NNNC)
C241  描述: 100nF ±10% 16V  [0402_C]  (hidden comment: CL05B104KO5NNNC)
C242  描述: 20pF ±5% 50V  [0402_C]  (hidden comment: 0402CG200J500NT)
C243  描述: 20pF ±5% 50V  [0402_C]  (hidden comment: 0402CG200J500NT)
C244  描述: 100nF ±10% 16V  [0402_C]  (hidden comment: CL05B104KO5NNNC)
C245  描述: 100nF ±10% 16V  [0402_C]  (hidden comment: CL05B104KO5NNNC)
C246  描述: 100nF ±10% 16V  [0402_C]  (hidden comment: CL05B104KO5NNNC)
C258  描述: 100nF ±10% 16V  [0402_C]  (hidden comment: CL05B104KO5NNNC)
C259  描述: 100nF ±10% 16V  [0402_C]  (hidden comment: CL05B104KO5NNNC)
C260  描述: 100nF ±10% 16V  [0402_C]  (hidden comment: CL05B104KO5NNNC)
C261  描述: 100nF ±10% 16V  [0402_C]  (hidden comment: CL05B104KO5NNNC)
C262  描述: 1nF ±10% 2kV  [1206_C]  (hidden comment: CC1206KKX7RDBB102)
D19  BV-D505ZC  [SOD-523]
D20  BV-D505ZC  [SOD-523]
D21  BS4200N-2C  [SMB-T_L5.4-W3.3-BI]
D22  BS4200N-2C  [SMB-T_L5.4-W3.3-BI]
D23  BV03C-H  [SOD-323]
D24  BV03C-H  [SOD-323]
D25  BV03C-H  [SOD-323]
D78  BV03C-H  [SOD-323]
J6  R-RJ45R08P-C000  [RJ45/LED-1575X1626X1310]  (value not drawn)
L21  BLM18KG121TN1D  [0603_R]  (value not drawn)
L22  VLS252012HBX-2R2M-1  [IND_252012]
R39  描述: 0Ω ±1%  [0805_R]  (hidden comment: 0805W8F0000T5E)  (no BOM)
R40  描述: 510Ω ±1%  [0402_R]  (hidden comment: 0402WGF5100TCE)
R41  描述: 10kΩ ±1%  [0402_R]  (hidden comment: 0402WGF1002TCE)
R42  描述: 510Ω ±1%  [0402_R]  (hidden comment: 0402WGF5100TCE)
R43  描述: 10kΩ ±1%  [0402_R]  (hidden comment: 0402WGF1002TCE)
R44  描述: 10kΩ ±1%  [0402_R]  (hidden comment: 0402WGF1002TCE)
R159  描述: 10kΩ ±1%  [0402_R]  (hidden comment: 0402WGF1002TCE)  (no BOM)
R162  描述: 10kΩ ±1%  [0402_R]  (hidden comment: 0402WGF1002TCE)
R185  描述: 10kΩ ±1%  [0402_R]  (hidden comment: 0402WGF1002TCE)
R186  描述: 2.49kΩ ±1%  [0402_R]  (hidden comment: AC0402FR-072K49L)
R187  描述: 75Ω ±1%  [0805_R]  (hidden comment: RS-05K75R0FT)
R188  描述: 75Ω ±1%  [0805_R]  (hidden comment: RS-05K75R0FT)
R226  描述: 75Ω ±1%  [0805_R]  (hidden comment: RS-05K75R0FT)
R227  描述: 75Ω ±1%  [0805_R]  (hidden comment: RS-05K75R0FT)
U29  W25Q32JVSSIQ  [SOIC-8-208mil]  (no BOM)
U43  RTL8153B-VB-CG  [QFN-40_L5.0-W5.0-P0.40-BL-EP3.7]  (value not drawn)
U44  描述: 千兆  [SMD-24_L15.1-W7.1-P1.00-LS10.0-BL]  (hidden comment: G2401CE)
Y3  X322525MSB4SI  [SMD-3225_4P]  (value not drawn)

### Ports
GND, HUB_D3_N (bidir), HUB_D3_P (bidir), USB3_HOST1_SSRX_N (out), USB3_HOST1_SSRX_P (out), USB3_HOST1_SSTX_N (in), USB3_HOST1_SSTX_P (in), VCC_3V3, VDD_5V_SYS

### Nets
EARTH: C262.1 D21.2 D22.2 J6.13(SH1) J6.14(SH2)
GND: C156.1 C193.1 C196.1 C197.1 C198.1 C217.1 C218.1 C219.1 C220.1 C221.1 C222.1 C223.1 C224.1 C225.1 C226.2 C239.1 C240.1 C241.1 C242.2 C243.1 C244.1 C245.1 C246.1 C258.1 C259.1 C260.1 C261.1 D19.1 D20.1 J6.10(LED_L-) J6.12(LED_R-) R43.1 R159.1 R186.2 U29.4(GND) U43.29(GND) U43.41(EP) Y3.2(NC) Y3.4(NC) ; port GND  [project net CHIP_GND]
PHY_3V3: C196.2 C197.2 C198.2 C217.2 C218.2 C219.2 C220.2 C226.1 R39.2 R41.2 R44.2 R162.2 R185.2 U29.8(VCC) U43.11(AVDD33) U43.20(AVDD33) U43.23(DVDD33) U43.26(VDDREG33) U43.33(DVDD33) U43.39(AVDD33) U43.40(AVDD33)
PHY_5V: C239.2 C240.2 C241.2 L21.2 U43.21(VDD5) U43.27(VDDREG5)
VCC_3V3: R39.1 ; port VCC_3V3  [project net VCC3V3]
VDD_5V_SYS: L21.1 ; port VDD_5V_SYS
DVDD10_UPS: C156.2 C193.2 U43.22(DVDD10_UPS)
EECS: R43.2 U43.31(EECS)
HUB_D3_N: U43.17(U2DM) ; port HUB_D3_N
HUB_D3_P: U43.18(U2DP) ; port HUB_D3_P
LED0/SPICSB: R40.1 U29.1(CS#) U43.32(LED0/SPICSB)
LED1/SPISCK: U29.6(CLK) U43.30(EESK/LED1/SPISCK)
LED2/SPISDO/LANWAKEB: R41.1 R42.1 U29.2(DO(IO1)) U43.24(EEDO/LED2/SPISDO/LANWAKEB/GPIO)
LED_G+: D20.2 J6.11(LED_R+) R42.2
LED_Y+: D19.2 J6.9(LED_L+) R40.2
MDI0/_N: J6.2(TD-) U44.14
MDI0/_P: J6.1(TD+) U44.13
MDI0_N: D23.1 U43.2(MDIN0) U44.11
MDI0_P: D23.2 U43.1(MDIP0) U44.12
MDI1/_N: J6.6(RD-) U44.17
MDI1/_P: J6.3(RD+) U44.16
MDI1_N: D25.1 U43.5(MDIN1) U44.8
MDI1_P: D25.2 U43.4(MDIP1) U44.9
MDI2/_N: J6.5(M2) U44.20
MDI2/_P: J6.4(M1) U44.19
MDI2_N: D24.1 U43.7(MDIN2) U44.5
MDI2_P: D24.2 U43.6(MDIP2) U44.6
MDI3/_N: J6.8(CHSGND) U44.23
MDI3/_P: J6.7(NC) U44.22
MDI3_N: D78.1 U43.10(MDIN3) U44.2
MDI3_P: D78.2 U43.9(MDIP3) U44.3
PHY_REGOUT: L22.1 U43.28(REGOUT)
PHY_VDD1V0: C221.2 C222.2 C223.2 C224.2 C225.2 C244.2 C245.2 C246.2 L22.2 U43.3(AVDD10) U43.8(AVDD10) U43.14(U3VDD10) U43.19(U2VDD10) U43.34(DVDD10) U43.37(AVDD10)
SPISDI/ENSWREG: R44.1 R159.2 U29.5(DI(IO0)) U43.25(EEDI/SPISDI/ENSWREG)
SSRX_N: U43.15(U3SSRXN) ; port USB3_HOST1_SSTX_N
SSRX_P: U43.16(U3SSRXP) ; port USB3_HOST1_SSTX_P
SSTX_N: C194.2 U43.12(U3SSTXN)
SSTX_P: C195.2 U43.13(U3SSTXP)
USB3_HOST1_SSRX_N: C194.1 ; port USB3_HOST1_SSRX_N
USB3_HOST1_SSRX_P: C195.1 ; port USB3_HOST1_SSRX_P
XTALI: C243.2 U43.35(CKXTAL1) Y3.1(X1)
XTALO: C242.1 U43.36(CKXTAL2) Y3.3(X2)
NetC258_2: C258.2 U44.1
NetC259_2: C259.2 U44.4
NetC260_2: C260.2 U44.7
NetC261_2: C261.2 U44.10
NetC262_2: C262.2 R187.2 R188.2 R226.2 R227.2
NetD21_1: D21.1 R188.1 U44.21
NetD21_3: D21.3 R187.1 U44.24
NetD22_1: D22.1 R227.1 U44.15
NetD22_3: D22.3 R226.1 U44.18
NetR162_1: R162.1 U29.7(HOLD)
NetR185_1: R185.1 U29.3(WP#(IO2))
NetR186_1: R186.1 U43.38(RSET)

Not connected (* = marked no-connect by the designer): J6 BO1(NC1)* BO2(NC2)*

### Layout directives
differential pair: HUB_D3_N, HUB_D3_P, MDI0/_N, MDI0/_P, MDI0_N, MDI0_P, MDI1/_N, MDI1/_P, MDI1_N, MDI1_P, MDI2/_N, MDI2/_P, MDI2_N, MDI2_P, MDI3/_N, MDI3/_P, MDI3_N, MDI3_P, SSRX_N, SSRX_P, USB3_HOST1_SSRX_N, USB3_HOST1_SSRX_P

### Notes on the sheet
- Close to PIN22
- Close to PIN23，33，39
- Close to PIN40
- Close to PIN11，26
- Close to PIN20
- Close to PIN28
- Close to PIN3，8，19，34，37
- Close to PIN14
- (near U29) SPI Flash CIRCUIT
- 产品名称
- 产品型号
- 设计人员
- 设计日期
- 审核人员
- 审核日期
- 图纸名称
- 图纸描述
- 图纸版本
- A3
- 广州灵眸科技有限公司
- (in symbol RJ45- 带LED灯 短体 不带弹片) S

### Library data of the parts
C156 C217-C220 C224 = 0402 1uF ±10% 25V: SPZL000337; 名称: 贴片电容; 厂商: SAMSUNG(三星); 封装: 0402; 工作温度: -55~85℃; 贴片和直插: SMD; 型号: CL05A105KA5NQNC; SuppliersPartNumber: C52923; 商品编号: SPZL000337
C193-C198 C221-C223 C226 C240 C241 C244-C246 C258-C261 = 0402 100nF ±10% 16V: SPZL000259; 名称: 贴片电容; 厂商: SAMSUNG(三星); 封装: 0402; 工作温度: -55~125℃; 贴片和直插: SMD; 型号: CL05B104KO5NNNC; SuppliersPartNumber: C1525; 商品编号: SPZL000259
C225 C239 = 0603 22uF ±20% 10V: SPZL000315; 名称: 贴片电容; 厂商: SAMSUNG(三星); 封装: 0603; 工作温度: -55~85℃; 贴片和直插: SMD; 型号: CL10A226MP8NUNE; SuppliersPartNumber: C86295; 商品编号: SPZL000315
C242 C243 = 0402 20pF ±5% 50V: SPZL000398; 名称: 贴片电容; 厂商: FH(风华); 封装: 0402; 工作温度: -55~125℃; 贴片和直插: SMD; 型号: 0402CG200J500NT; SuppliersPartNumber: C1554; 商品编号: SPZL000398
C262 = 1206 1nF ±10% 2kV: SPZL000332; 名称: 贴片电容; 厂商: YAGEO(国巨); 封装: 1206; 工作温度: -55~125℃; 贴片和直插: SMD; 型号: CC1206KKX7RDBB102; SuppliersPartNumber: C23631; 商品编号: SPZL000332
D19 D20 = ESD BV-D505ZC: SPZL000613; 名称: ESD; 贴片和直插: SMD; 厂商: Bencent(槟城); 描述: Vdrm=5V Cj=15pF; 工作温度: -40~125℃; SuppliersPartNumber: C459520; 封装: SOD-523; 商品编号: SPZL000613; 型号: BV-D505ZC
D21 D22 = 放电管 BS4200N-2C: SPZL000612; 名称: 放电管; 封装: SMB-T; 贴片和直插: SMD; 厂商: Bencent(槟城); 工作温度: -40~125℃; 商品编号: SPZL000612; 型号: BS4200N-2C
D23-D25 D78 = ESD BV03C-H: SPZL000614; 名称: ESD; 贴片和直插: SMD; 厂商: Bencent(槟城); 描述: Vdrm=3.3V Cj=1.5pF; 工作温度: -55~150℃; 封装: SOD-323; SuppliersPartNumber: C883203; 商品编号: SPZL000614; 型号: BV03C-H
J6 = RJ45- 带LED灯 短体 不带弹片: SPZL000140; 名称: RJ45插座; 贴片和直插: THT; 封装: Through Hole; 厂商: Ckmtw(灿科盟); 工作温度: 0~70℃; SuppliersPartNumber: C386757; 型号: R-RJ45R08P-C000; 商品编号: SPZL000140; 描述: RJ45- 带LED灯 短体 不带弹片
L21 = 120Ω ±25% @100MHz 3A: SPZL000842; 名称: 磁珠; 封装: 0603; 厂商: muRata(村田); 贴片和直插: SMD; 工作温度: -40~85℃; SuppliersPartNumber: C85831; 型号: BLM18KG121TN1D; 商品编号: SPZL000842; 描述: 120Ω ±25% @100MHz 3A
L22 = 2.2uH ±20% 2.04A: SPZL000205; 名称: 电感; 厂商: TDK; 封装: 1008; 贴片和直插: SMD; 工作温度: -40~105℃; 型号: VLS252012HBX-2R2M-1; SuppliersPartNumber: C88535; 商品编号: SPZL000205; 描述: 2.2uH ±20% 2.04A
R39 = 0805 0Ω ±1%: SPZL000350; 封装: 0805; 厂商: UNI-ROYAL(厚声); 名称: 电阻; 贴片和直插: SMD; 工作温度: -55~155℃; SuppliersPartNumber: C17477; 型号: 0805W8F0000T5E; 商品编号: SPZL000350
R40 R42 = 0402 510Ω ±1%: SPZL000335; 封装: 0402; 厂商: UNI-ROYAL(厚声); 贴片和直插: SMD; 名称: 电阻; 工作温度: -55~155℃; SuppliersPartNumber: C25123; 型号: 0402WGF5100TCE; 商品编号: SPZL000335
R41 R43 R44 R159 R162 R185 = 0402 10kΩ ±1%: SPZL000271; 封装: 0402; 厂商: UNI-ROYAL(厚声); 贴片和直插: SMD; 名称: 电阻; 工作温度: -55~155℃; SuppliersPartNumber: C25744; 型号: 0402WGF1002TCE; 商品编号: SPZL000271
R186 = 0402 2.49kΩ ±1%: SPZL000354; 封装: 0402; 厂商: YAGEO(国巨); 贴片和直插: SMD; 名称: 电阻; 工作温度: -55~155℃; SuppliersPartNumber: C226959; 型号: AC0402FR-072K49L; 商品编号: SPZL000354
R187 R188 R226 R227 = 0805 75Ω ±1%: SPZL000353; 封装: 0805; 厂商: FH(风华); 名称: 电阻; 贴片和直插: SMD; 工作温度: -55~155℃; SuppliersPartNumber: C139842; 型号: RS-05K75R0FT; 商品编号: SPZL000353
U29 = W25Q32JVSSIQ: SPZL001045; 名称: IC; 描述: NOR FLASH; 厂商: WINBOND(华邦); 封装: SOIC-8; 贴片和直插: SMD; 工作温度: -40~85℃; 商品编号: SPZL001045; SuppliersPartNumber: C179173; 型号: W25Q32JVSSIQ
U43 = RTL8153B-VB-CG: SPZL001044; 名称: IC; 描述: USB3.0转千兆芯片; 厂商: REALTEK(瑞昱); 封装: QFN-40-EP(5x5); 工作温度: 0~70℃; 贴片和直插: SMD; SuppliersPartNumber: C2802072; 型号: RTL8153B-VB-CG; 商品编号: SPZL001044
U44 = 网络变压器 G2401CE: SPZL000720; 封装: SMD; 名称: 网络变压器; 厂商: Mentech(铭普光磁); 工作温度: -40~+85℃; 型号: G2401CE; 贴片和直插: SMD; SuppliersPartNumber: C2904710; 商品编号: SPZL000720
Y3 = 25MHZ 20PF 10PPM: SPZL000475; 封装: SMD3225-4P; 厂商: YXC扬兴科技; 贴片和直插: SMD; 名称: 无源晶振; 工作温度: -40~85℃; SuppliersPartNumber: C13740; 型号: X322525MSB4SI; 商品编号: SPZL000475; 描述: 25MHZ 20PF 10PPM

## Sheet 16.USB_HUB_GL3510.SchDoc
size A3; CheckedBy: YPC; DocumentNumber: 16; Revision: V1.00; SheetNumber: 16; SheetTotal: 18; SheetName: USB_HUB_GL3510; SheetDescribe: USB3.1 Gen1 Hub Controller 原理子图; Designer: JOW; DesignDate: 2025-04-25; CheckedData: 2025-04-25; Rule: PcbType=ProtelPcb
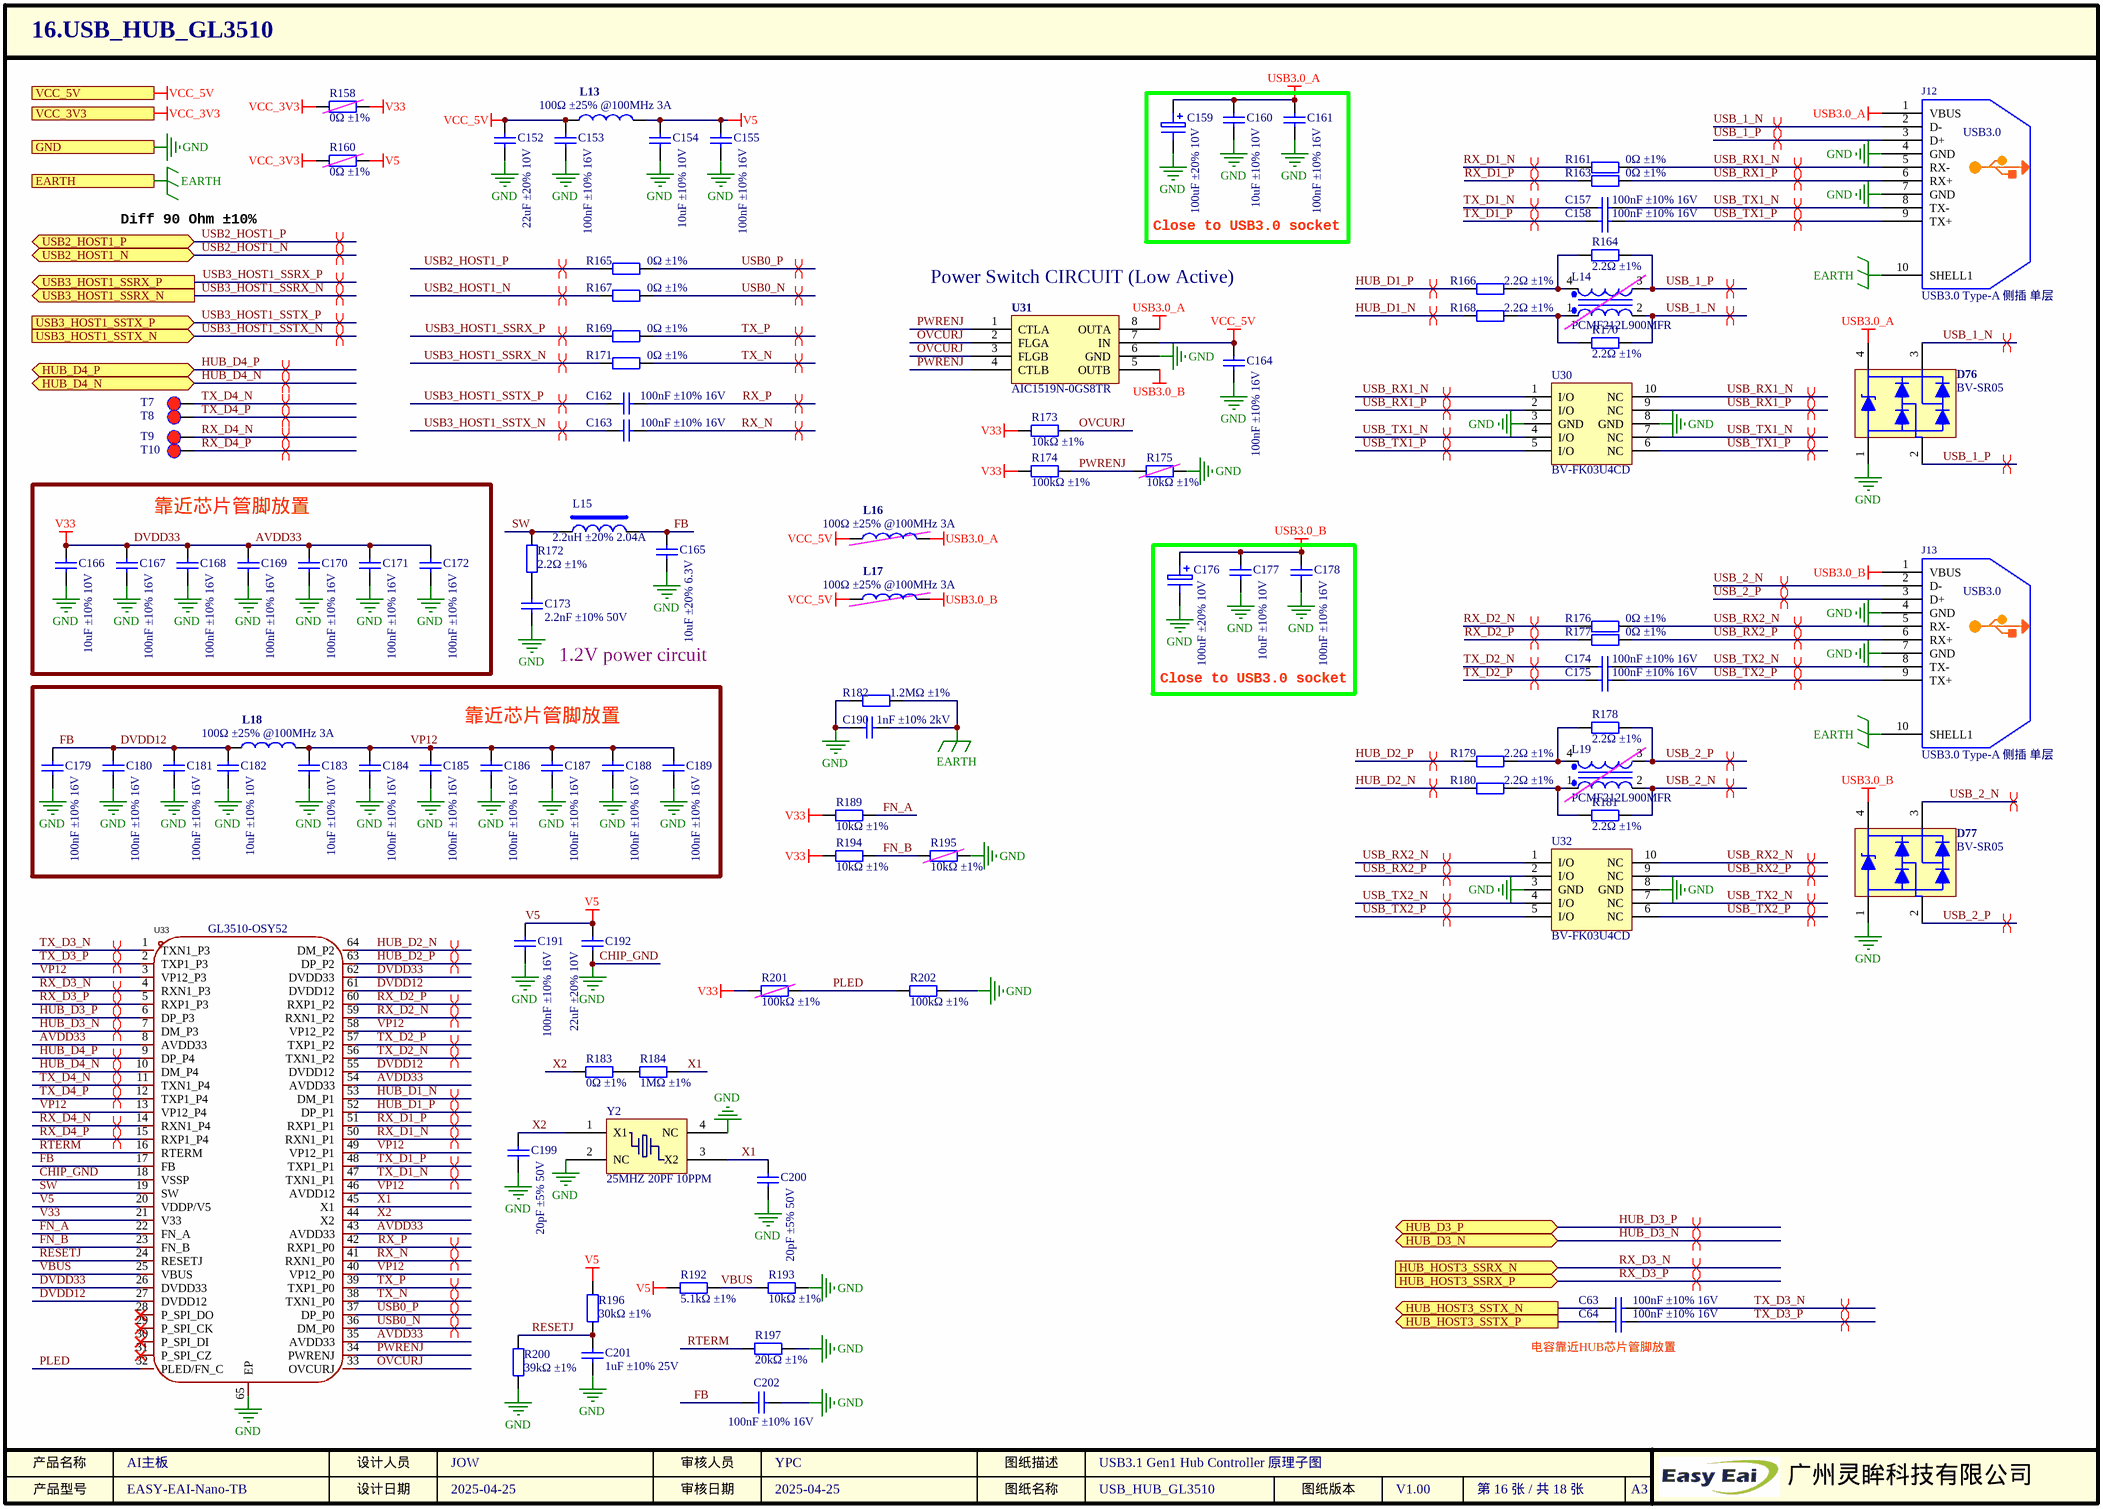
[diagram p15: 16.USB_HUB_GL3510.SchDoc]

### Parts
C63  描述: 100nF ±10% 16V  [0402_C]  (hidden comment: CL05B104KO5NNNC)
C64  描述: 100nF ±10% 16V  [0402_C]  (hidden comment: CL05B104KO5NNNC)
C152  描述: 22uF ±20% 10V  [0603_C]  (hidden comment: CL10A226MP8NUNE)
C153  描述: 100nF ±10% 16V  [0402_C]  (hidden comment: CL05B104KO5NNNC)
C154  描述: 10uF ±10% 10V  [0603_C]  (hidden comment: CL10A106KP8NNNC)
C155  描述: 100nF ±10% 16V  [0402_C]  (hidden comment: CL05B104KO5NNNC)
C157  描述: 100nF ±10% 16V  [0402_C]  (hidden comment: CL05B104KO5NNNC)
C158  描述: 100nF ±10% 16V  [0402_C]  (hidden comment: CL05B104KO5NNNC)
C159  描述: 100uF ±20% 10V  [SMD,D5xL5.4mm]  (hidden comment: RVT1A101M0505)
C160  描述: 10uF ±10% 10V  [0603_C]  (hidden comment: CL10A106KP8NNNC)
C161  描述: 100nF ±10% 16V  [0402_C]  (hidden comment: CL05B104KO5NNNC)
C162  描述: 100nF ±10% 16V  [0402_C]  (hidden comment: CL05B104KO5NNNC)
C163  描述: 100nF ±10% 16V  [0402_C]  (hidden comment: CL05B104KO5NNNC)
C164  描述: 100nF ±10% 16V  [0402_C]  (hidden comment: CL05B104KO5NNNC)
C165  描述: 10uF ±20% 6.3V  [0402_C]  (hidden comment: CL05A106MQ5NUNC)
C166  描述: 10uF ±10% 10V  [0603_C]  (hidden comment: CL10A106KP8NNNC)
C167  描述: 100nF ±10% 16V  [0402_C]  (hidden comment: CL05B104KO5NNNC)
C168  描述: 100nF ±10% 16V  [0402_C]  (hidden comment: CL05B104KO5NNNC)
C169  描述: 100nF ±10% 16V  [0402_C]  (hidden comment: CL05B104KO5NNNC)
C170  描述: 100nF ±10% 16V  [0402_C]  (hidden comment: CL05B104KO5NNNC)
C171  描述: 100nF ±10% 16V  [0402_C]  (hidden comment: CL05B104KO5NNNC)
C172  描述: 100nF ±10% 16V  [0402_C]  (hidden comment: CL05B104KO5NNNC)
C173  描述: 2.2nF ±10% 50V  [0402_C]  (hidden comment: 0402B222K500NT)
C174  描述: 100nF ±10% 16V  [0402_C]  (hidden comment: CL05B104KO5NNNC)
C175  描述: 100nF ±10% 16V  [0402_C]  (hidden comment: CL05B104KO5NNNC)
C176  描述: 100uF ±20% 10V  [SMD,D5xL5.4mm]  (hidden comment: RVT1A101M0505)
C177  描述: 10uF ±10% 10V  [0603_C]  (hidden comment: CL10A106KP8NNNC)
C178  描述: 100nF ±10% 16V  [0402_C]  (hidden comment: CL05B104KO5NNNC)
C179  描述: 100nF ±10% 16V  [0402_C]  (hidden comment: CL05B104KO5NNNC)
C180  描述: 100nF ±10% 16V  [0402_C]  (hidden comment: CL05B104KO5NNNC)
C181  描述: 100nF ±10% 16V  [0402_C]  (hidden comment: CL05B104KO5NNNC)
C182  描述: 10uF ±10% 10V  [0603_C]  (hidden comment: CL10A106KP8NNNC)
C183  描述: 10uF ±10% 10V  [0603_C]  (hidden comment: CL10A106KP8NNNC)
C184  描述: 100nF ±10% 16V  [0402_C]  (hidden comment: CL05B104KO5NNNC)
C185  描述: 100nF ±10% 16V  [0402_C]  (hidden comment: CL05B104KO5NNNC)
C186  描述: 100nF ±10% 16V  [0402_C]  (hidden comment: CL05B104KO5NNNC)
C187  描述: 100nF ±10% 16V  [0402_C]  (hidden comment: CL05B104KO5NNNC)
C188  描述: 100nF ±10% 16V  [0402_C]  (hidden comment: CL05B104KO5NNNC)
C189  描述: 100nF ±10% 16V  [0402_C]  (hidden comment: CL05B104KO5NNNC)
C190  描述: 1nF ±10% 2kV  [1206_C]  (hidden comment: CC1206KKX7RDBB102)
C191  描述: 100nF ±10% 16V  [0402_C]  (hidden comment: CL05B104KO5NNNC)
C192  描述: 22uF ±20% 10V  [0603_C]  (hidden comment: CL10A226MP8NUNE)
C199  描述: 20pF ±5% 50V  [0402_C]  (hidden comment: 0402CG200J500NT)
C200  描述: 20pF ±5% 50V  [0402_C]  (hidden comment: 0402CG200J500NT)
C201  描述: 1uF ±10% 25V  [0402_C]  (hidden comment: CL05A105KA5NQNC)
C202  描述: 100nF ±10% 16V  [0402_C]  (hidden comment: CL05B104KO5NNNC)
D76  BV-SR05  [SOT-143]
D77  BV-SR05  [SOT-143]
J12  U231-091N-4BLCC14-S5  [USB3.0-A-TH_U231-091N-4BLCC14-S-5]  (value not drawn)
J13  U231-091N-4BLCC14-S5  [USB3.0-A-TH_U231-091N-4BLCC14-S-5]  (value not drawn)
L13  MPZ1608S101ATAH0  [0603_R]  (value not drawn)
L14  PCMF212L900MFR  [SMD2012]  (no BOM)
L15  VLS252012HBX-2R2M-1  [IND_252012]  (value not drawn)
L16  MPZ1608S101ATAH0  [0603_R]  (value not drawn)  (no BOM)
L17  MPZ1608S101ATAH0  [0603_R]  (value not drawn)  (no BOM)
L18  MPZ1608S101ATAH0  [0603_R]  (value not drawn)
L19  PCMF212L900MFR  [SMD2012]  (no BOM)
R158  描述: 0Ω ±1%  [0805_R]  (hidden comment: 0805W8F0000T5E)  (no BOM)
R160  描述: 0Ω ±1%  [0805_R]  (hidden comment: 0805W8F0000T5E)  (no BOM)
R161  描述: 0Ω ±1%  [0402_R]  (hidden comment: 0402WGF0000TCE)
R163  描述: 0Ω ±1%  [0402_R]  (hidden comment: 0402WGF0000TCE)
R164  描述: 2.2Ω ±1%  [0402_R]  (hidden comment: 0402WGF220KTCE)
R165  描述: 0Ω ±1%  [0402_R]  (hidden comment: 0402WGF0000TCE)
R166  描述: 2.2Ω ±1%  [0402_R]  (hidden comment: 0402WGF220KTCE)
R167  描述: 0Ω ±1%  [0402_R]  (hidden comment: 0402WGF0000TCE)
R168  描述: 2.2Ω ±1%  [0402_R]  (hidden comment: 0402WGF220KTCE)
R169  描述: 0Ω ±1%  [0402_R]  (hidden comment: 0402WGF0000TCE)
R170  描述: 2.2Ω ±1%  [0402_R]  (hidden comment: 0402WGF220KTCE)
R171  描述: 0Ω ±1%  [0402_R]  (hidden comment: 0402WGF0000TCE)
R172  描述: 2.2Ω ±1%  [0402_R]  (hidden comment: 0402WGF220KTCE)
R173  描述: 10kΩ ±1%  [0402_R]  (hidden comment: 0402WGF1002TCE)
R174  描述: 100kΩ ±1%  [0402_R]  (hidden comment: 0402WGF1003TCE)
R175  描述: 10kΩ ±1%  [0402_R]  (hidden comment: 0402WGF1002TCE)  (no BOM)
R176  描述: 0Ω ±1%  [0402_R]  (hidden comment: 0402WGF0000TCE)
R177  描述: 0Ω ±1%  [0402_R]  (hidden comment: 0402WGF0000TCE)
R178  描述: 2.2Ω ±1%  [0402_R]  (hidden comment: 0402WGF220KTCE)
R179  描述: 2.2Ω ±1%  [0402_R]  (hidden comment: 0402WGF220KTCE)
R180  描述: 2.2Ω ±1%  [0402_R]  (hidden comment: 0402WGF220KTCE)
R181  描述: 2.2Ω ±1%  [0402_R]  (hidden comment: 0402WGF220KTCE)
R182  描述: 1.2MΩ ±1%  [1206_R]  (hidden comment: 1206W4F1204T5E)
R183  描述: 0Ω ±1%  [0402_R]  (hidden comment: 0402WGF0000TCE)
R184  描述: 1MΩ ±1%  [0402_R]  (hidden comment: RC-02W1004FT)
R189  描述: 10kΩ ±1%  [0402_R]  (hidden comment: 0402WGF1002TCE)
R192  描述: 5.1kΩ ±1%  [0402_R]  (hidden comment: 0402WGF5101TCE)
R193  描述: 10kΩ ±1%  [0402_R]  (hidden comment: 0402WGF1002TCE)
R194  描述: 10kΩ ±1%  [0402_R]  (hidden comment: 0402WGF1002TCE)
R195  描述: 10kΩ ±1%  [0402_R]  (hidden comment: 0402WGF1002TCE)  (no BOM)
R196  描述: 30kΩ ±1%  [0402_R]  (hidden comment: NQ02WGF3002TCE)
R197  描述: 20kΩ ±1%  [0402_R]  (hidden comment: 0402WGF2002TCE)
R200  描述: 39kΩ ±1%  [0402_R]  (hidden comment: RC0402FR-0739KL)
R201  描述: 100kΩ ±1%  [0402_R]  (hidden comment: 0402WGF1003TCE)  (no BOM)
R202  描述: 100kΩ ±1%  [0402_R]  (hidden comment: 0402WGF1003TCE)
T7  TEST-DOT  [PAD-25/40]  (value not drawn)  (no BOM)
T8  TEST-DOT  [PAD-25/40]  (value not drawn)  (no BOM)
T9  TEST-DOT  [PAD-25/40]  (value not drawn)  (no BOM)
T10  TEST-DOT  [PAD-25/40]  (value not drawn)  (no BOM)
U30  型号: BV-FK03U4CD  [UDFN-10]  (hidden comment: ESD BV-FK03U4CD)
U31  AIC1519N-0GS8TR  [SOP-8]
U32  型号: BV-FK03U4CD  [UDFN-10]  (hidden comment: ESD BV-FK03U4CD)
U33  GL3510-OSY52  [QFN-64_L8.0-W8.0-P0.40-BL-EP5.4]
Y2  X322525MSB4SI  [SMD-3225_4P]  (value not drawn)

### Blocks framed on the sheet
Close to USB3.0 socket: C159-C161
靠近芯片管脚放置: C166-C172
Close to USB3.0 socket: C176-C178
靠近芯片管脚放置: C179-C189 L18

### Ports
EARTH, GND, HUB_D3_N (bidir), HUB_D3_P (bidir), HUB_D4_N (bidir), HUB_D4_P (bidir), HUB_HOST3_SSRX_N (in), HUB_HOST3_SSRX_P (in), HUB_HOST3_SSTX_N (out), HUB_HOST3_SSTX_P (out), USB2_HOST1_N (bidir), USB2_HOST1_P (bidir), USB3_HOST1_SSRX_N (out), USB3_HOST1_SSRX_P (out), USB3_HOST1_SSTX_N (in), USB3_HOST1_SSTX_P (in), VCC_3V3 (in), VCC_5V (in)

### Nets
AVDD33: C166.1 C167.1 C168.1 C169.1 C170.1 C171.1 C172.1 R158.2 R173.1 R174.1 R189.2 R194.2 R201.1 U33.8(AVDD33) U33.21(V33) U33.26(DVDD33) U33.35(AVDD33) U33.43(AVDD33) U33.54(AVDD33) U33.62(DVDD33)  [also labelled DVDD33, V33]
CHIP_GND: C152.1 C153.2 C154.1 C155.2 C159.2 C160.1 C161.1 C164.1 C165.1 C166.2 C167.2 C168.2 C169.2 C170.2 C171.2 C172.2 C173.1 C176.2 C177.1 C178.1 C179.2 C180.2 C181.2 C182.2 C183.2 C184.2 C185.2 C186.2 C187.2 C188.2 C189.2 C190.1 C191.2 C192.1 C199.1 C200.1 C201.1 C202.1 D76.1 D77.1 J12.4(GND) J12.7(GND) J13.4(GND) J13.7(GND) R175.1 R182.1 R193.1 R195.1 R197.2 R200.1 R202.2 U30.3(GND) U30.8(GND) U31.6(GND) U32.3(GND) U32.8(GND) U33.18(VSSP) U33.65(EP) Y2.2(NC) Y2.4(NC) ; port GND  [also labelled GND]
EARTH: C190.2 J12.10(SHELL1) J13.10(SHELL1) R182.2 ; port EARTH
USB3.0_A: C159.1 C160.2 C161.2 D76.4 J12.1(VBUS) L16.2 U31.8(OUTA)
USB3.0_B: C176.1 C177.2 C178.2 D77.4 J13.1(VBUS) L17.2 U31.5(OUTB)
V5: C154.2 C155.1 C191.1 C192.2 L13.2 R160.2 R192.1 R196.2 U33.20(VDDP/V5)
VCC_3V3: R158.1 R160.1 ; port VCC_3V3  [project net VCC3V3]
VCC_5V: C152.2 C153.1 C164.2 L13.1 L16.1 L17.1 U31.7(IN) ; port VCC_5V
DVDD12: C165.2 C179.1 C180.1 C181.1 C182.1 C202.2 L15.2 L18.1 U33.17(FB) U33.27(DVDD12) U33.55(DVDD12) U33.61(DVDD12)  [also labelled FB]
FN_A: R189.1 U33.22(FN_A)
FN_B: R194.1 R195.2 U33.23(FN_B)
HUB_D1_N: R168.1 U33.53(DM_P1)
HUB_D1_P: R166.1 U33.52(DP_P1)
HUB_D2_N: R180.1 U33.64(DM_P2)
HUB_D2_P: R179.1 U33.63(DP_P2)
HUB_D3_N: U33.7(DM_P3) ; port HUB_D3_N
HUB_D3_P: U33.6(DP_P3) ; port HUB_D3_P
HUB_D4_N: U33.10(DM_P4) ; port HUB_D4_N
HUB_D4_P: U33.9(DP_P4) ; port HUB_D4_P
OVCURJ: R173.2 U31.2(FLGA) U31.3(FLGB) U33.33(OVCURJ)
PLED: R201.2 R202.1 U33.32(PLED/FN_C)
PWRENJ: R174.2 R175.2 U31.1(CTLA) U31.4(CTLB) U33.34(PWRENJ)
RESETJ: C201.2 R196.1 R200.2 U33.24(RESETJ)
RTERM: R197.1 U33.16(RTERM)
RX_D1_N: R161.1 U33.50(RXN1_P1)
RX_D1_P: R163.1 U33.51(RXP1_P1)
RX_D2_N: R176.1 U33.59(RXN1_P2)
RX_D2_P: R177.1 U33.60(RXP1_P2)
RX_D3_N: U33.4(RXN1_P3) ; port HUB_HOST3_SSRX_N
RX_D3_P: U33.5(RXP1_P3) ; port HUB_HOST3_SSRX_P
RX_D4_N: T9.1 U33.14(RXN1_P4)
RX_D4_P: T10.1 U33.15(RXP1_P4)
RX_N: C163.1 U33.41(RXN1_P0)
RX_P: C162.1 U33.42(RXP1_P0)
SW: L15.1 R172.2 U33.19(SW)
TX_D1_N: C157.1 U33.47(TXN1_P1)
TX_D1_P: C158.1 U33.48(TXP1_P1)
TX_D2_N: C174.1 U33.56(TXN1_P2)
TX_D2_P: C175.1 U33.57(TXP1_P2)
TX_D3_N: C63.1 U33.1(TXN1_P3)
TX_D3_P: C64.1 U33.2(TXP1_P3)
TX_D4_N: T7.1 U33.11(TXN1_P4)
TX_D4_P: T8.1 U33.12(TXP1_P4)
TX_N: R171.2 U33.38(TXN1_P0)
TX_P: R169.2 U33.39(TXP1_P0)
USB0_N: R167.2 U33.36(DM_P0)
USB0_P: R165.2 U33.37(DP_P0)
USB2_HOST1_N: R167.1 ; port USB2_HOST1_N
USB2_HOST1_P: R165.1 ; port USB2_HOST1_P
USB3_HOST1_SSRX_N: R171.1 ; port USB3_HOST1_SSRX_N
USB3_HOST1_SSRX_P: R169.1 ; port USB3_HOST1_SSRX_P
USB3_HOST1_SSTX_N: C163.2 ; port USB3_HOST1_SSTX_N  [project net SSRX_N]
USB3_HOST1_SSTX_P: C162.2 ; port USB3_HOST1_SSTX_P  [project net SSRX_P]
USB_1_N: D76.3 J12.2(D-) L14.2 R170.2
USB_1_P: D76.2 J12.3(D+) L14.3 R164.2
USB_2_N: D77.3 J13.2(D-) L19.2 R181.2
USB_2_P: D77.2 J13.3(D+) L19.3 R178.2
USB_RX1_N: J12.5(RX-) R161.2 U30.1(I/O) U30.10(NC)
USB_RX1_P: J12.6(RX+) R163.2 U30.2(I/O) U30.9(NC)
USB_RX2_N: J13.5(RX-) R176.2 U32.1(I/O) U32.10(NC)
USB_RX2_P: J13.6(RX+) R177.2 U32.2(I/O) U32.9(NC)
USB_TX1_N: C157.2 J12.8(TX-) U30.4(I/O) U30.7(NC)
USB_TX1_P: C158.2 J12.9(TX+) U30.5(I/O) U30.6(NC)
USB_TX2_N: C174.2 J13.8(TX-) U32.4(I/O) U32.7(NC)
USB_TX2_P: C175.2 J13.9(TX+) U32.5(I/O) U32.6(NC)
VBUS: R192.2 R193.2 U33.25(VBUS)
VP12: C183.1 C184.1 C185.1 C186.1 C187.1 C188.1 C189.1 L18.2 U33.3(VP12_P3) U33.13(VP12_P4) U33.40(VP12_P0) U33.46(AVDD12) U33.49(VP12_P1) U33.58(VP12_P2)
X1: C200.2 R184.2 U33.45(X1) Y2.3(X2)
X2: C199.2 R183.1 U33.44(X2) Y2.1(X1)
NetC63_2: C63.2 ; port HUB_HOST3_SSTX_N
NetC64_2: C64.2 ; port HUB_HOST3_SSTX_P
NetC173_2: C173.2 R172.1
NetL14_1: L14.1 R168.2 R170.1
NetL14_4: L14.4 R164.1 R166.2
NetL19_1: L19.1 R180.2 R181.1
NetL19_4: L19.4 R178.1 R179.2
NetR183_2: R183.2 R184.1

Not connected (* = marked no-connect by the designer): U33 28(P_SPI_DO)* 29(P_SPI_CK)* 30(P_SPI_DI)* 31(P_SPI_CZ)*

### Layout directives
differential pair: HUB_D1_N, HUB_D1_P, HUB_D2_N, HUB_D2_P, HUB_D3_N, HUB_D3_P, HUB_D4_N, HUB_D4_P, RX_D1_N, RX_D1_P, RX_D2_N, RX_D2_P, RX_D3_N, RX_D3_P, RX_D4_N, RX_D4_P, RX_N, RX_P, SSRX_N, SSRX_P, TX_D1_N, TX_D1_P, TX_D2_N, TX_D2_P, TX_D3_N, TX_D3_P, TX_D4_N, TX_D4_P, TX_N, TX_P, USB0_N, USB0_P, USB2_HOST1_N, USB2_HOST1_P, USB3_HOST1_SSRX_N, USB3_HOST1_SSRX_P, USB_1_N, USB_1_P, USB_2_N, USB_2_P, USB_RX1_N, USB_RX1_P, USB_RX2_N, USB_RX2_P, USB_TX1_N, USB_TX1_P, USB_TX2_N, USB_TX2_P

### Notes on the sheet
- Diff 90 Ohm ±10%
- (near U31) Power Switch CIRCUIT (Low Active)
- (near C173) 1.2V power circuit
- 电容靠近HUB芯片管脚放置
- 产品名称
- 产品型号
- 设计人员
- 设计日期
- 审核人员
- 审核日期
- 图纸名称
- 图纸描述
- 图纸版本
- A3
- 广州灵眸科技有限公司
- (in symbol USB3.0 Type-A 侧插 单层) USB3.0

### Library data of the parts
C63 C64 C153 C155 C157 C158 C161-C164 C167-C172 C174 C175 C178-C181 C184-C189 C191 C202 = 0402 100nF ±10% 16V: as C193-C198 on sheet 08.USB3.0-RGMII; 型号: CL05B104KO5NNNC; SuppliersPartNumber: C1525; 商品编号: SPZL000259
C152 C192 = 0603 22uF ±20% 10V: as C225 on sheet 08.USB3.0-RGMII; 型号: CL10A226MP8NUNE; SuppliersPartNumber: C86295; 商品编号: SPZL000315
C154 C160 C166 C177 C182 C183 = 0603 10uF ±10% 10V: SPZL000260; 名称: 贴片电容; 厂商: SAMSUNG(三星); 封装: 0603; 工作温度: -55~85℃; 贴片和直插: SMD; 型号: CL10A106KP8NNNC; SuppliersPartNumber: C19702; 商品编号: SPZL000260
C159 C176 = 电解电容 100uF ±20% 10V: SPZL000265; 名称: 电解电容; 厂商: ROQANG(容强); 贴片和直插: SMD; 工作温度: -55~105℃; SuppliersPartNumber: C72473; 封装: SMD,D5xL5.4mm; 型号: RVT1A101M0505; 商品编号: SPZL000265
C165 = 0402 10uF ±20% 6.3V: SPZL000269; 名称: 贴片电容; 厂商: SAMSUNG(三星); 封装: 0402; 工作温度: -55~85℃; 贴片和直插: SMD; 型号: CL05A106MQ5NUNC; SuppliersPartNumber: C15525; 商品编号: SPZL000269
C173 = 0402 2.2nF ±10% 50V: SPZL000399; 名称: 贴片电容; 厂商: FH(风华); 封装: 0402; 工作温度: -55~125℃; 贴片和直插: SMD; 型号: 0402B222K500NT; SuppliersPartNumber: C1531; 商品编号: SPZL000399
C190 = 1206 1nF ±10% 2kV: as C262 on sheet 08.USB3.0-RGMII; 型号: CC1206KKX7RDBB102; SuppliersPartNumber: C23631; 商品编号: SPZL000332
C199 C200 = 0402 20pF ±5% 50V: as C242 on sheet 08.USB3.0-RGMII; 型号: 0402CG200J500NT; SuppliersPartNumber: C1554; 商品编号: SPZL000398
C201 = 0402 1uF ±10% 25V: as C156 on sheet 08.USB3.0-RGMII; 型号: CL05A105KA5NQNC; SuppliersPartNumber: C52923; 商品编号: SPZL000337
D76 D77 = TVS BV-SR05: SPZL000616; 名称: TVS; 厂商: Bencent(槟城); 贴片和直插: SMD; 描述: Vdrm=5V Cj=0.85pF; 工作温度: -40~125℃; 封装: SOT-143; SuppliersPartNumber: C413946; 商品编号: SPZL000616; 型号: BV-SR05
J12 J13 = USB3.0 Type-A 侧插 单层: SPZL001065; 名称: USB连接器; 封装: THT; 厂商: XKB Connectivity(中国星坤); 工作温度: -55~85℃; 贴片和直插: THT; SuppliersPartNumber: C388644; 型号: U231-091N-4BLCC14-S5; 商品编号: SPZL001065; 描述: USB3.0 Type-A 侧插 单层
L13 L16-L18 = 100Ω ±25% @100MHz 3A: SPZL000753; 名称: 磁珠; 封装: 0603; 厂商: TDK; 贴片和直插: SMD; 工作温度: -40~85℃; SuppliersPartNumber: C107332; 型号: MPZ1608S101ATAH0; 商品编号: SPZL000753; 描述: 100Ω ±25% @100MHz 3A
L14 L19 = 共模电感 PCMF212L900MFR: SPZL001149; 名称: 共模电感; 厂商: 玛珂斯科技; 贴片和直插: SMD; 描述: 90Ω @100MHz 400mA; 工作温度: -40~85℃; 封装: SMD2012; 商品编号: SPZL001149; 型号: PCMF212L900MFR
L15 = 2.2uH ±20% 2.04A: as L22 on sheet 08.USB3.0-RGMII; 型号: VLS252012HBX-2R2M-1; SuppliersPartNumber: C88535; 商品编号: SPZL000205; 描述: 2.2uH ±20% 2.04A
R158 R160 = 0805 0Ω ±1%: as R39 on sheet 08.USB3.0-RGMII; SuppliersPartNumber: C17477; 型号: 0805W8F0000T5E; 商品编号: SPZL000350
R161 R163 R165 R167 R169 R171 R176 R177 R183 = 0402 0Ω ±1%: SPZL000276; 封装: 0402; 厂商: UNI-ROYAL(厚声); 贴片和直插: SMD; 名称: 电阻; 工作温度: -55~125℃; SuppliersPartNumber: C17168; 型号: 0402WGF0000TCE; 商品编号: SPZL000276
R164 R166 R168 R170 R172 R178-R181 = 0402 2.2Ω ±1%: SPZL000327; 封装: 0402; 厂商: UNI-ROYAL(厚声); 贴片和直插: SMD; 名称: 电阻; 工作温度: -55~155℃; SuppliersPartNumber: C25101; 型号: 0402WGF220KTCE; 商品编号: SPZL000327
R173 R175 R189 R193-R195 = 0402 10kΩ ±1%: as R41 on sheet 08.USB3.0-RGMII; SuppliersPartNumber: C25744; 型号: 0402WGF1002TCE; 商品编号: SPZL000271
R174 R201 R202 = 0402 100kΩ ±1%: SPZL000282; 封装: 0402; 厂商: UNI-ROYAL(厚声); 贴片和直插: SMD; 名称: 电阻; 工作温度: -55~155℃; SuppliersPartNumber: C25741; 型号: 0402WGF1003TCE; 商品编号: SPZL000282
R182 = 1206 1.2MΩ ±1%: SPZL000388; 封装: 1206; 厂商: UNI-ROYAL(厚声); 名称: 电阻; 贴片和直插: SMD; 工作温度: -55~155℃; SuppliersPartNumber: C22107; 型号: 1206W4F1204T5E; 商品编号: SPZL000388
R184 = 0402 1MΩ ±1%: SPZL000301; 封装: 0402; 厂商: FH(风华); 贴片和直插: SMD; 名称: 电阻; 工作温度: -55~125℃; SuppliersPartNumber: C310185; 型号: RC-02W1004FT; 商品编号: SPZL000301
R192 = 0402 5.1kΩ ±1%: SPZL000270; 封装: 0402; 厂商: UNI-ROYAL(厚声); 贴片和直插: SMD; 名称: 电阻; 工作温度: -55~155℃; SuppliersPartNumber: C25905; 型号: 0402WGF5101TCE; 商品编号: SPZL000270
R196 = 0402 30kΩ ±1%: SPZL000323; 封装: 0402; 厂商: UNI-ROYAL(厚声); 贴片和直插: SMD; 名称: 电阻; 工作温度: -55~155℃; SuppliersPartNumber: C965267; 型号: NQ02WGF3002TCE; 商品编号: SPZL000323
R197 = 0402 20kΩ ±1%: SPZL000349; 封装: 0402; 厂商: UNI-ROYAL(厚声); 贴片和直插: SMD; 名称: 电阻; 工作温度: -55~155℃; SuppliersPartNumber: C25765; 型号: 0402WGF2002TCE; 商品编号: SPZL000349
R200 = 0402 39kΩ ±1%: SPZL001271; 封装: 0402; 厂商: YAGEO(国巨); 贴片和直插: SMD; 名称: 电阻; 工作温度: -55~155℃; SuppliersPartNumber: C137995; 型号: RC0402FR-0739KL; 商品编号: SPZL001271
U30 U32 = ESD BV-FK03U4CD: SPZL000610; 厂商: Bencent(槟城); 贴片和直插: SMD; 描述: Vdrm=3.3V Cj=0.65pF; 工作温度: -40~125℃; 名称: ESD; 封装: UDFN-10; 商品编号: SPZL000610
U31 = AIC1519N-0GS8TR: SPZL001272; 名称: IC; 厂商: AIC(沛亨半导体); 贴片和直插: SMD; 描述: 双USB电源开关; 工作温度: -40℃~+85℃; 封装: SOP-8; SuppliersPartNumber: C211637; 商品编号: SPZL001272; 型号: AIC1519N-0GS8TR
U33 = GL3510-OSY52: SPZL001270; 名称: IC; 描述: USB3.1Gen1 Hub芯片; 厂商: GENESYS(创惟); 工作温度: 0~70℃; 封装: QFN64; 贴片和直插: SMD; 型号: GL3510-OSY52; 商品编号: SPZL001270; SuppliersPartNumber: C7501408
Y2 = 25MHZ 20PF 10PPM: as Y3 on sheet 08.USB3.0-RGMII; SuppliersPartNumber: C13740; 型号: X322525MSB4SI; 商品编号: SPZL000475; 描述: 25MHZ 20PF 10PPM